# Altium project IntegratedShelfControl.PrjPCB (part 1 of 2)
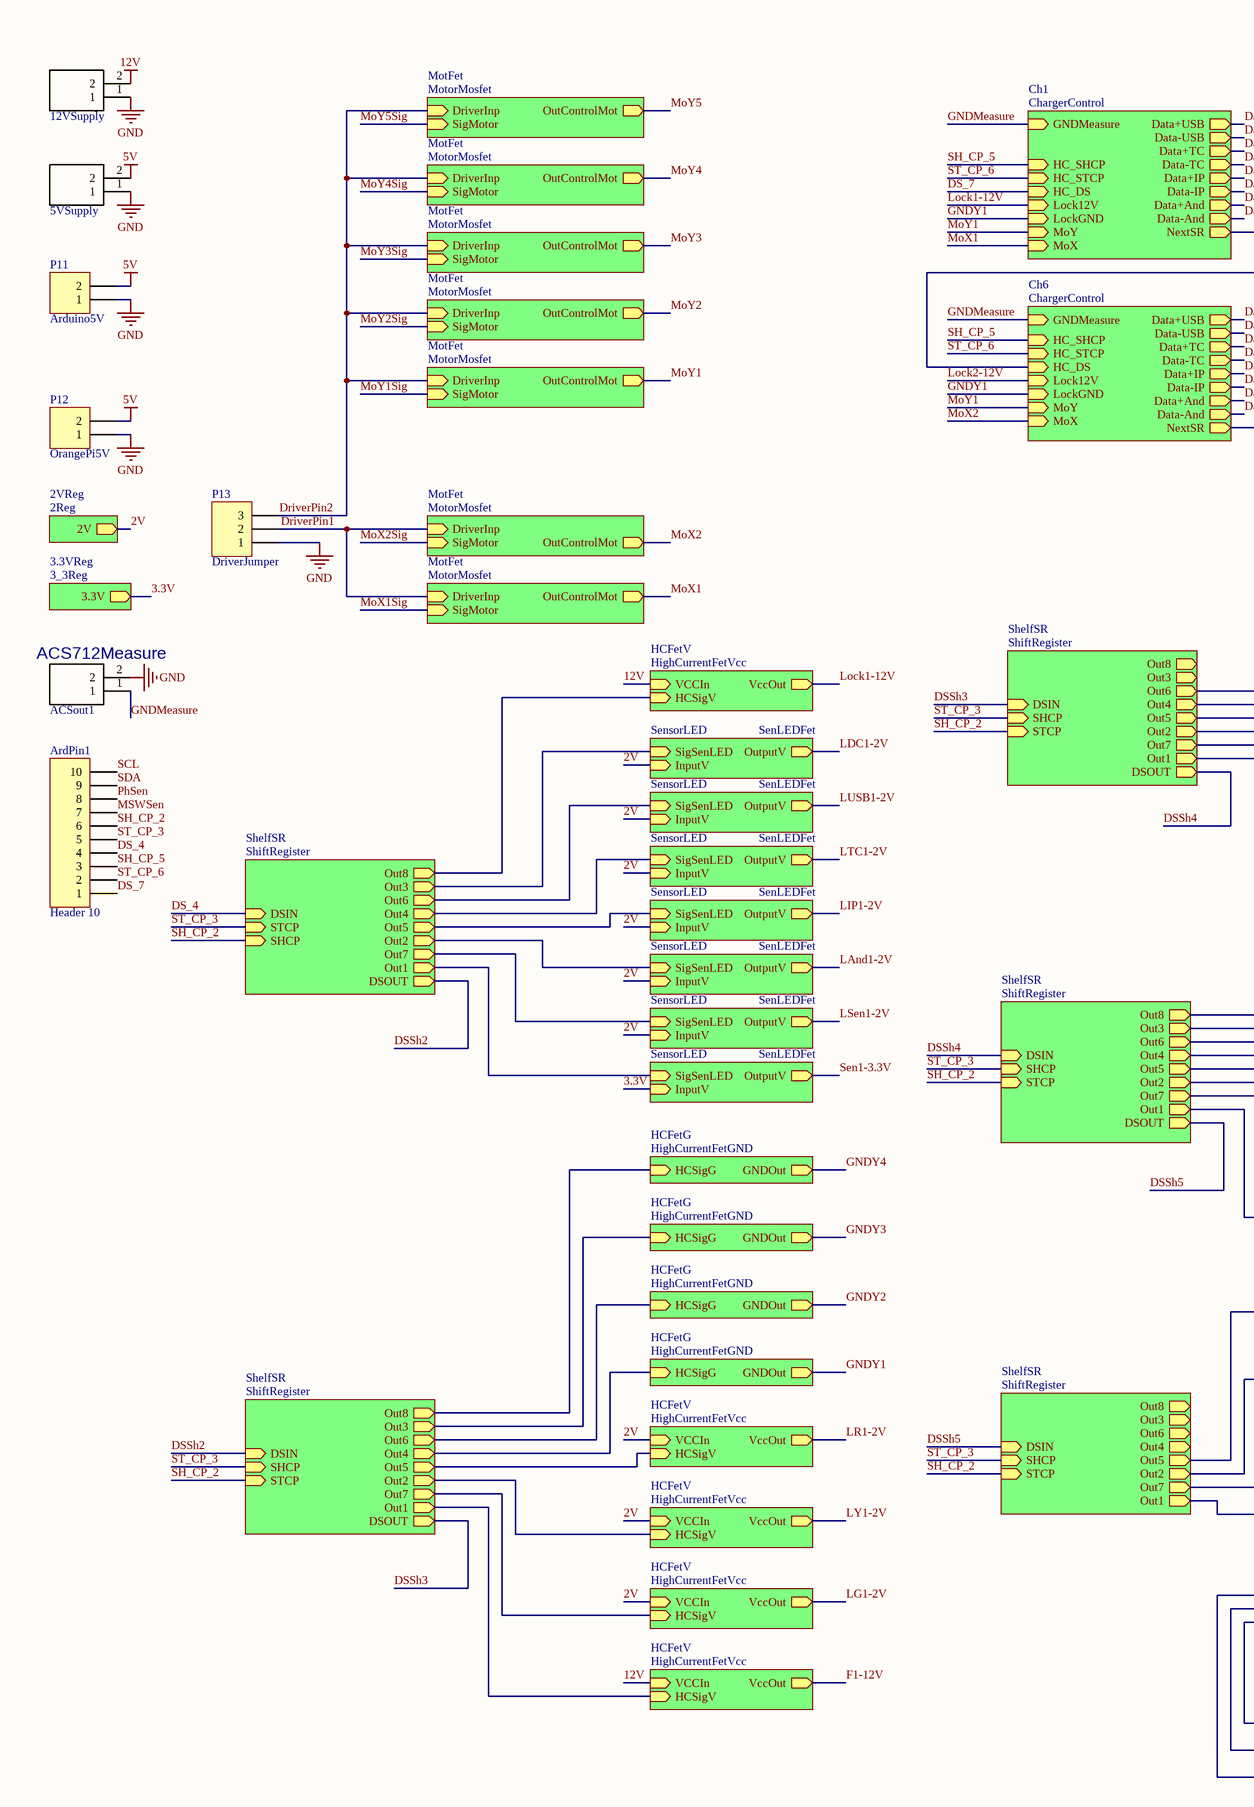
[diagram p0: ISC.SchDoc, left]
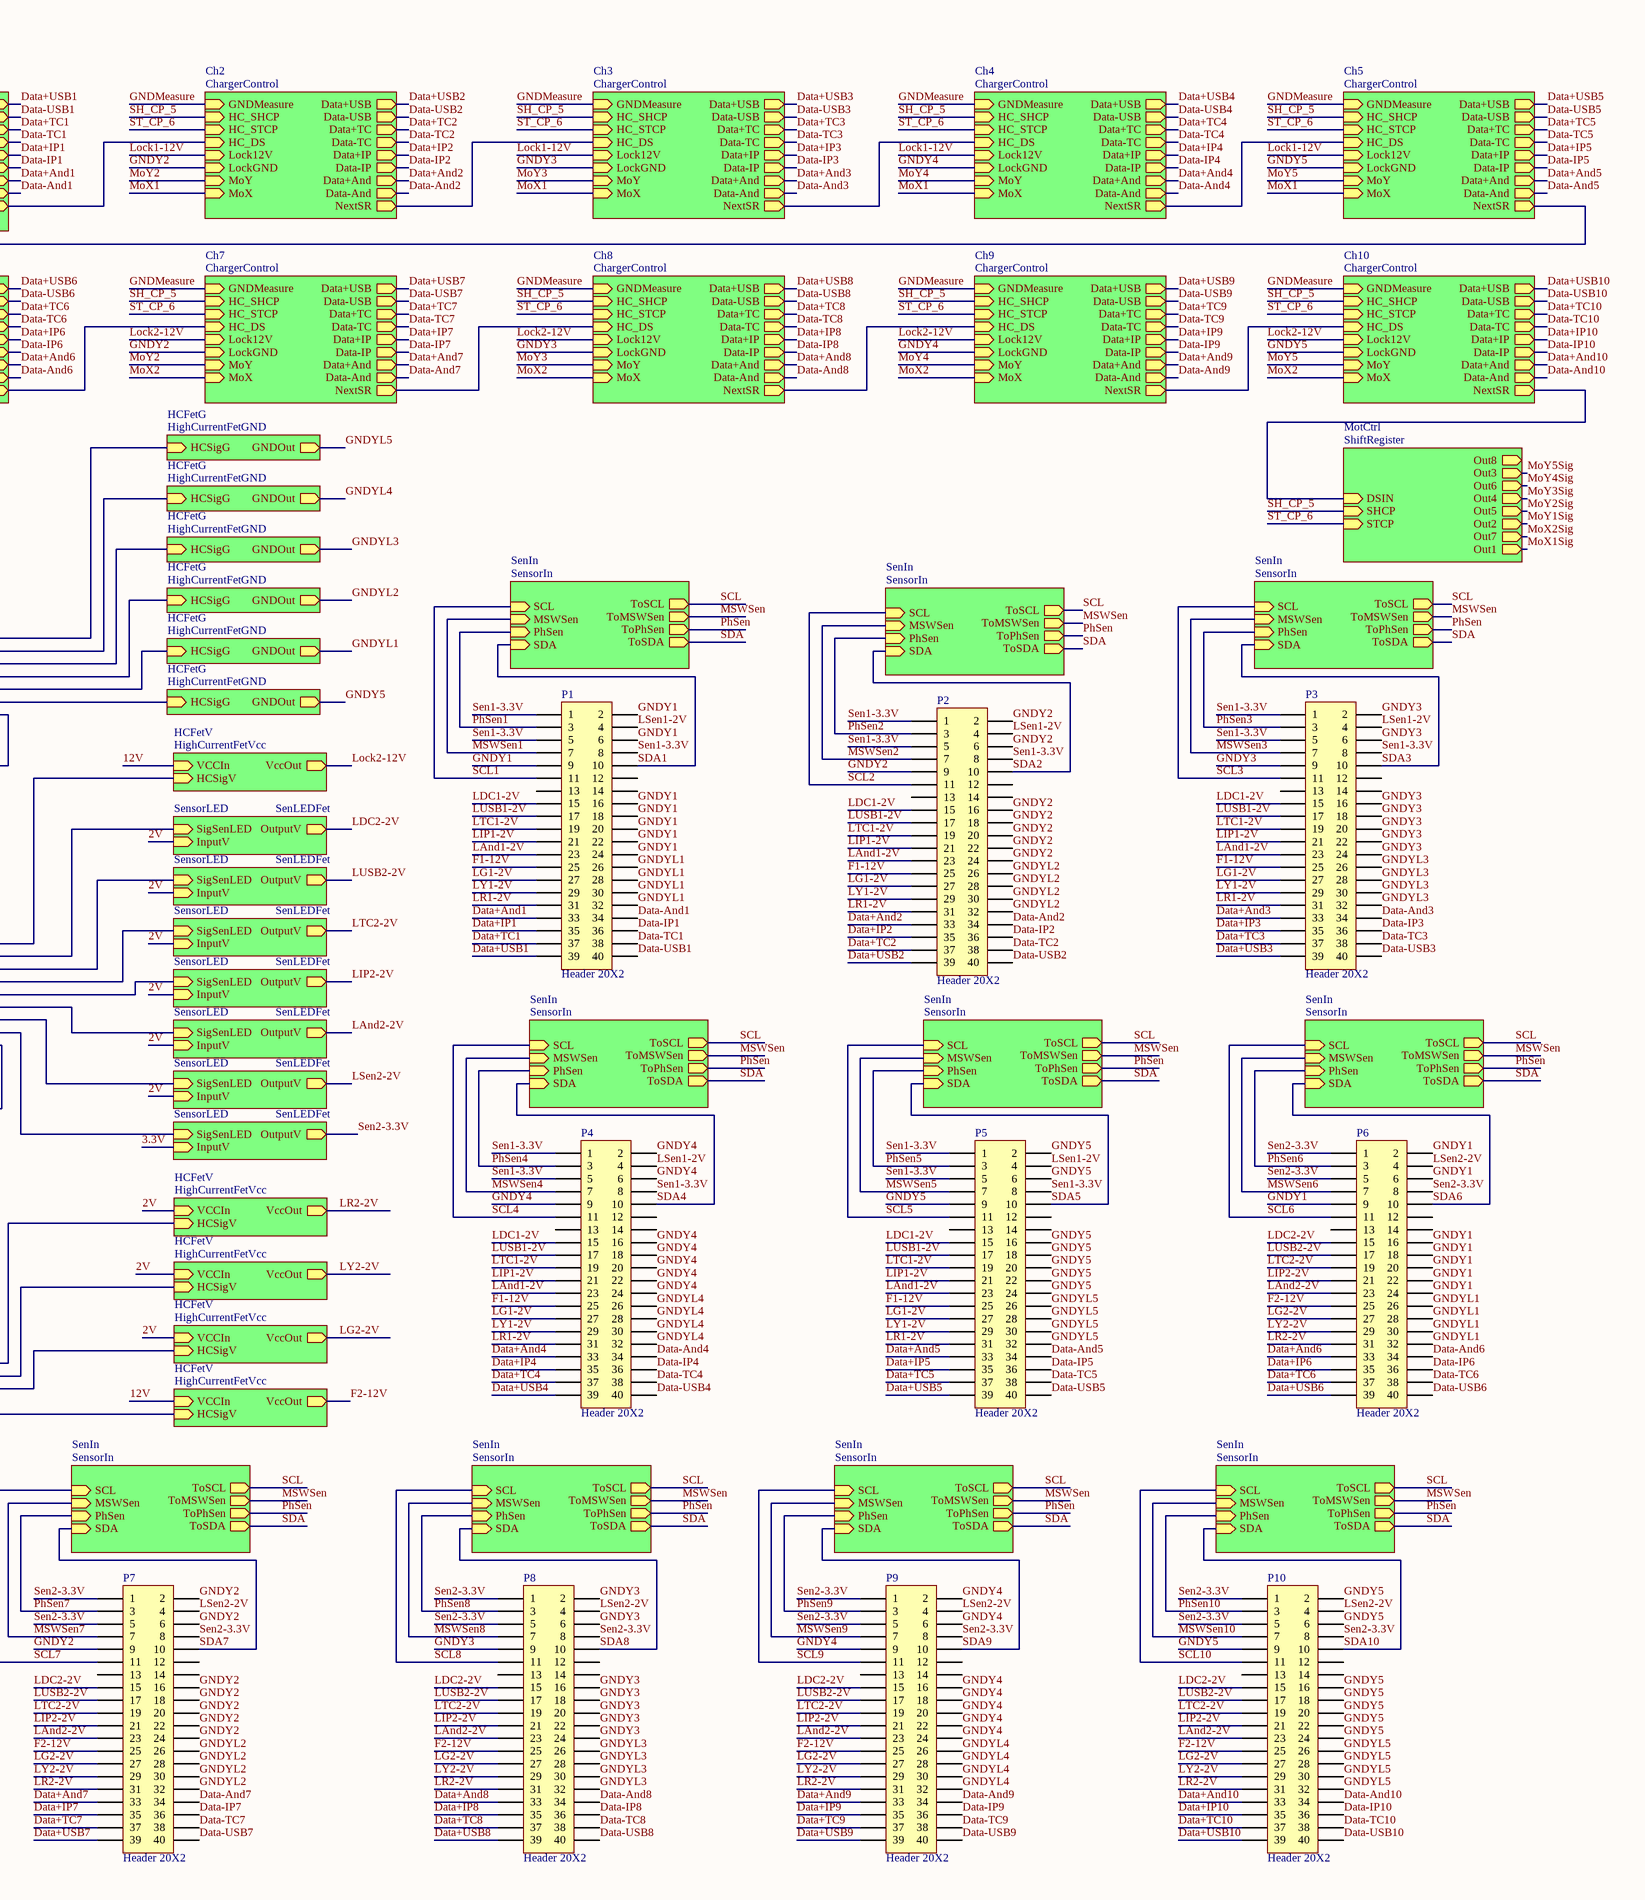
[diagram p1: ISC.SchDoc, right]
10 sheets, 689 parts. Net scope: hierarchical (ports join the sheet entries above them; power ports are global).
Board file: ISC.PcbDoc
Sheets:
  ISC.SchDoc
    Ch1 = ChargerControl.SchDoc
    MotFet = MotorMosfet.SchDoc
    3.3VReg = 3_3Reg.SchDoc
    2VReg = 2Reg.SchDoc
    HCFetV = HighCurrentFetVcc.SchDoc
    MotFet = MotorMosfet.SchDoc
    MotFet = MotorMosfet.SchDoc
    MotFet = MotorMosfet.SchDoc
    MotFet = MotorMosfet.SchDoc
    MotFet = MotorMosfet.SchDoc
    MotFet = MotorMosfet.SchDoc
    MotCtrl = ShiftRegister.SchDoc
    ShelfSR = ShiftRegister.SchDoc
    ShelfSR = ShiftRegister.SchDoc
    ShelfSR = ShiftRegister.SchDoc
    ShelfSR = ShiftRegister.SchDoc
    ShelfSR = ShiftRegister.SchDoc
    SensorLED = SenLEDFet.SchDoc
    HCFetV = HighCurrentFetVcc.SchDoc
    HCFetV = HighCurrentFetVcc.SchDoc
    HCFetV = HighCurrentFetVcc.SchDoc
    HCFetV = HighCurrentFetVcc.SchDoc
    HCFetG = HighCurrentFetGND.SchDoc
    HCFetG = HighCurrentFetGND.SchDoc
    HCFetG = HighCurrentFetGND.SchDoc
    HCFetG = HighCurrentFetGND.SchDoc
    SensorLED = SenLEDFet.SchDoc
    SensorLED = SenLEDFet.SchDoc
    SensorLED = SenLEDFet.SchDoc
    SensorLED = SenLEDFet.SchDoc
    SensorLED = SenLEDFet.SchDoc
    SensorLED = SenLEDFet.SchDoc
    HCFetG = HighCurrentFetGND.SchDoc
    HCFetG = HighCurrentFetGND.SchDoc
    HCFetG = HighCurrentFetGND.SchDoc
    HCFetG = HighCurrentFetGND.SchDoc
    HCFetG = HighCurrentFetGND.SchDoc
    HCFetG = HighCurrentFetGND.SchDoc
    HCFetV = HighCurrentFetVcc.SchDoc
    SensorLED = SenLEDFet.SchDoc
    SensorLED = SenLEDFet.SchDoc
    SensorLED = SenLEDFet.SchDoc
    SensorLED = SenLEDFet.SchDoc
    SensorLED = SenLEDFet.SchDoc
    SensorLED = SenLEDFet.SchDoc
    SensorLED = SenLEDFet.SchDoc
    HCFetV = HighCurrentFetVcc.SchDoc
    HCFetV = HighCurrentFetVcc.SchDoc
    HCFetV = HighCurrentFetVcc.SchDoc
    HCFetV = HighCurrentFetVcc.SchDoc
    Ch2 = ChargerControl.SchDoc
    Ch3 = ChargerControl.SchDoc
    Ch4 = ChargerControl.SchDoc
    Ch5 = ChargerControl.SchDoc
    Ch6 = ChargerControl.SchDoc
    Ch7 = ChargerControl.SchDoc
    Ch8 = ChargerControl.SchDoc
    Ch9 = ChargerControl.SchDoc
    Ch10 = ChargerControl.SchDoc
    SenIn = SensorIn.SchDoc
    SenIn = SensorIn.SchDoc
    SenIn = SensorIn.SchDoc
    SenIn = SensorIn.SchDoc
    SenIn = SensorIn.SchDoc
    SenIn = SensorIn.SchDoc
    SenIn = SensorIn.SchDoc
    SenIn = SensorIn.SchDoc
    SenIn = SensorIn.SchDoc
    SenIn = SensorIn.SchDoc

## Sheet ISC.SchDoc
size A2

### Parts
5VSupply  6-1123723-2  [*TE_6-1123723-2]  (value not drawn)
12VSupply  6-1123723-2  [*TE_6-1123723-2]  (value not drawn)
ACSout1  ACS712Measure  [*TE_6-1123723-2]
ArdPin1  Header 10  [HDR1X10]
P1  Header 20X2  [HDR2X20]
P2  Header 20X2  [HDR2X20]
P3  Header 20X2  [HDR2X20]
P4  Header 20X2  [HDR2X20]
P5  Header 20X2  [HDR2X20]
P6  Header 20X2  [HDR2X20]
P7  Header 20X2  [HDR2X20]
P8  Header 20X2  [HDR2X20]
P9  Header 20X2  [HDR2X20]
P10  Header 20X2  [HDR2X20]
P11  Arduino5V  [HDR1X2]
P12  OrangePi5V  [HDR1X2]
P13  DriverJumper  [HDR1X3]

### Sub-sheets
2VReg = 2Reg: 2V (out)
3.3VReg = 3_3Reg: 3.3V (out)
Ch1 = ChargerControl: GNDMeasure (in), HC_SHCP (in), HC_STCP (in), HC_DS (in), Data+USB (out), Data-USB (out), Data-TC (out), Data+TC (out), Data-And (out), Data+IP (out), Data-IP (out), Data+And (out), NextSR (out), Lock12V (in), LockGND (in), MoY (in), MoX (in)
Ch2 = ChargerControl: GNDMeasure (in), MoY (in), MoX (in), HC_SHCP (in), HC_STCP (in), HC_DS (in), Data+USB (out), Data-USB (out), Data-TC (out), Data+TC (out), Data-And (out), Data+IP (out), Data-IP (out), Data+And (out), NextSR (out), Lock12V (in), LockGND (in)
Ch3 = ChargerControl: GNDMeasure (in), MoY (in), MoX (in), HC_SHCP (in), HC_STCP (in), HC_DS (in), Data+USB (out), Data-USB (out), Data-TC (out), Data+TC (out), Data-And (out), Data+IP (out), Data-IP (out), Data+And (out), NextSR (out), Lock12V (in), LockGND (in)
Ch4 = ChargerControl: GNDMeasure (in), MoY (in), MoX (in), HC_SHCP (in), HC_STCP (in), HC_DS (in), Data+USB (out), Data-USB (out), Data-TC (out), Data+TC (out), Data-And (out), Data+IP (out), Data-IP (out), Data+And (out), NextSR (out), Lock12V (in), LockGND (in)
Ch5 = ChargerControl: GNDMeasure (in), MoY (in), MoX (in), HC_SHCP (in), HC_STCP (in), HC_DS (in), Data+USB (out), Data-USB (out), Data-TC (out), Data+TC (out), Data-And (out), Data+IP (out), Data-IP (out), Data+And (out), NextSR (out), Lock12V (in), LockGND (in)
Ch6 = ChargerControl: GNDMeasure (in), Data+USB (out), Data-USB (out), Data-TC (out), Data+TC (out), Data-And (out), Data+IP (out), Data-IP (out), Data+And (out), NextSR (out), HC_SHCP (in), HC_STCP (in), HC_DS (in), Lock12V (in), LockGND (in), MoY (in), MoX (in)
Ch7 = ChargerControl: GNDMeasure (in), MoY (in), MoX (in), HC_SHCP (in), HC_STCP (in), HC_DS (in), Data+USB (out), Data-USB (out), Data-TC (out), Data+TC (out), Data-And (out), Data+IP (out), Data-IP (out), Data+And (out), NextSR (out), Lock12V (in), LockGND (in)
Ch8 = ChargerControl: GNDMeasure (in), MoY (in), MoX (in), HC_SHCP (in), HC_STCP (in), HC_DS (in), Data+USB (out), Data-USB (out), Data-TC (out), Data+TC (out), Data-And (out), Data+IP (out), Data-IP (out), Data+And (out), NextSR (out), Lock12V (in), LockGND (in)
Ch9 = ChargerControl: GNDMeasure (in), MoY (in), MoX (in), HC_SHCP (in), HC_STCP (in), HC_DS (in), Data+USB (out), Data-USB (out), Data-TC (out), Data+TC (out), Data-And (out), Data+IP (out), Data-IP (out), Data+And (out), NextSR (out), Lock12V (in), LockGND (in)
Ch10 = ChargerControl: GNDMeasure (in), MoY (in), MoX (in), HC_SHCP (in), HC_STCP (in), HC_DS (in), Data+USB (out), Data-USB (out), Data-TC (out), Data+TC (out), Data-And (out), Data+IP (out), Data-IP (out), Data+And (out), NextSR (out), Lock12V (in), LockGND (in)
HCFetG = HighCurrentFetGND: HCSigG (in), GNDOut (out)
HCFetG = HighCurrentFetGND: HCSigG (in), GNDOut (out)
HCFetG = HighCurrentFetGND: HCSigG (in), GNDOut (out)
HCFetG = HighCurrentFetGND: HCSigG (in), GNDOut (out)
HCFetG = HighCurrentFetGND: HCSigG (in), GNDOut (out)
HCFetG = HighCurrentFetGND: HCSigG (in), GNDOut (out)
HCFetG = HighCurrentFetGND: HCSigG (in), GNDOut (out)
HCFetG = HighCurrentFetGND: HCSigG (in), GNDOut (out)
HCFetG = HighCurrentFetGND: HCSigG (in), GNDOut (out)
HCFetG = HighCurrentFetGND: HCSigG (in), GNDOut (out)
HCFetV = HighCurrentFetVcc: HCSigV (in), VCCIn (in), VccOut (out)
HCFetV = HighCurrentFetVcc: HCSigV (in), VCCIn (in), VccOut (out)
HCFetV = HighCurrentFetVcc: HCSigV (in), VCCIn (in), VccOut (out)
HCFetV = HighCurrentFetVcc: HCSigV (in), VCCIn (in), VccOut (out)
HCFetV = HighCurrentFetVcc: HCSigV (in), VCCIn (in), VccOut (out)
HCFetV = HighCurrentFetVcc: HCSigV (in), VCCIn (in), VccOut (out)
HCFetV = HighCurrentFetVcc: HCSigV (in), VCCIn (in), VccOut (out)
HCFetV = HighCurrentFetVcc: HCSigV (in), VCCIn (in), VccOut (out)
HCFetV = HighCurrentFetVcc: HCSigV (in), VCCIn (in), VccOut (out)
HCFetV = HighCurrentFetVcc: HCSigV (in), VCCIn (in), VccOut (out)
MotCtrl = ShiftRegister: DSIN (in), SHCP (in), STCP (in), Out8 (out), Out3 (out), Out6 (out), Out4 (out), Out5 (out), Out2 (out), Out7 (out), Out1 (out)
MotFet = MotorMosfet: DriverInp (in), SigMotor (in), OutControlMot (out)
MotFet = MotorMosfet: DriverInp (in), SigMotor (in), OutControlMot (out)
MotFet = MotorMosfet: DriverInp (in), SigMotor (in), OutControlMot (out)
MotFet = MotorMosfet: DriverInp (in), SigMotor (in), OutControlMot (out)
MotFet = MotorMosfet: DriverInp (in), SigMotor (in), OutControlMot (out)
MotFet = MotorMosfet: DriverInp (in), SigMotor (in), OutControlMot (out)
MotFet = MotorMosfet: DriverInp (in), SigMotor (in), OutControlMot (out)
SenIn = SensorIn: SCL (in), MSWSen (in), PhSen (in), SDA (in), ToSCL (out), ToMSWSen (out), ToPhSen (out), ToSDA (out)
SenIn = SensorIn: SCL (in), MSWSen (in), PhSen (in), SDA (in), ToSCL (out), ToMSWSen (out), ToPhSen (out), ToSDA (out)
SenIn = SensorIn: SCL (in), MSWSen (in), PhSen (in), SDA (in), ToSCL (out), ToMSWSen (out), ToPhSen (out), ToSDA (out)
SenIn = SensorIn: SCL (in), MSWSen (in), PhSen (in), SDA (in), ToSCL (out), ToMSWSen (out), ToPhSen (out), ToSDA (out)
SenIn = SensorIn: SCL (in), MSWSen (in), PhSen (in), SDA (in), ToSCL (out), ToMSWSen (out), ToPhSen (out), ToSDA (out)
SenIn = SensorIn: SCL (in), MSWSen (in), PhSen (in), SDA (in), ToSCL (out), ToMSWSen (out), ToPhSen (out), ToSDA (out)
SenIn = SensorIn: SCL (in), MSWSen (in), PhSen (in), SDA (in), ToSCL (out), ToMSWSen (out), ToPhSen (out), ToSDA (out)
SenIn = SensorIn: SCL (in), MSWSen (in), PhSen (in), SDA (in), ToSCL (out), ToMSWSen (out), ToPhSen (out), ToSDA (out)
SenIn = SensorIn: SCL (in), MSWSen (in), PhSen (in), SDA (in), ToSCL (out), ToMSWSen (out), ToPhSen (out), ToSDA (out)
SenIn = SensorIn: SCL (in), MSWSen (in), PhSen (in), SDA (in), ToSCL (out), ToMSWSen (out), ToPhSen (out), ToSDA (out)
SensorLED = SenLEDFet: SigSenLED (in), OutputV (out), InputV (in)
SensorLED = SenLEDFet: SigSenLED (in), OutputV (out), InputV (in)
SensorLED = SenLEDFet: SigSenLED (in), OutputV (out), InputV (in)
SensorLED = SenLEDFet: SigSenLED (in), OutputV (out), InputV (in)
SensorLED = SenLEDFet: SigSenLED (in), OutputV (out), InputV (in)
SensorLED = SenLEDFet: SigSenLED (in), OutputV (out), InputV (in)
SensorLED = SenLEDFet: SigSenLED (in), OutputV (out), InputV (in)
SensorLED = SenLEDFet: SigSenLED (in), OutputV (out), InputV (in)
SensorLED = SenLEDFet: SigSenLED (in), OutputV (out), InputV (in)
SensorLED = SenLEDFet: SigSenLED (in), OutputV (out), InputV (in)
SensorLED = SenLEDFet: SigSenLED (in), OutputV (out), InputV (in)
SensorLED = SenLEDFet: SigSenLED (in), OutputV (out), InputV (in)
SensorLED = SenLEDFet: SigSenLED (in), OutputV (out), InputV (in)
SensorLED = SenLEDFet: SigSenLED (in), OutputV (out), InputV (in)
ShelfSR = ShiftRegister: DSIN (in), SHCP (in), STCP (in), Out8 (out), Out3 (out), Out6 (out), Out4 (out), Out5 (out), Out2 (out), Out7 (out), Out1 (out), DSOUT (out)
ShelfSR = ShiftRegister: DSIN (in), SHCP (in), STCP (in), Out8 (out), Out3 (out), Out6 (out), Out4 (out), Out5 (out), Out2 (out), Out7 (out), Out1 (out), DSOUT (out)
ShelfSR = ShiftRegister: DSIN (in), SHCP (in), STCP (in), Out8 (out), Out3 (out), Out6 (out), Out4 (out), Out5 (out), Out2 (out), Out7 (out), Out1 (out), DSOUT (out)
ShelfSR = ShiftRegister: DSIN (in), SHCP (in), STCP (in), Out8 (out), Out3 (out), Out6 (out), Out4 (out), Out5 (out), Out2 (out), Out7 (out), Out1 (out), DSOUT (out)
ShelfSR = ShiftRegister: DSIN (in), SHCP (in), STCP (in), Out8 (out), Out3 (out), Out6 (out), Out4 (out), Out5 (out), Out2 (out), Out7 (out), Out1 (out)

### Nets
5V: 5VSupply.2 P11.2 P12.2
12V: 12VSupply.2 ; sheet HCFetV/VCCIn, sheet HCFetV/VCCIn, sheet HCFetV/VCCIn, sheet HCFetV/VCCIn
GND: 5VSupply.1 12VSupply.1 ACSout1.2 P11.1 P12.1 P13.1
2V: sheet 2VReg/2V, sheet SensorLED/InputV, sheet HCFetV/VCCIn, sheet HCFetV/VCCIn, sheet HCFetV/VCCIn, sheet SensorLED/InputV, sheet SensorLED/InputV, sheet SensorLED/InputV, sheet SensorLED/InputV, sheet SensorLED/InputV, sheet SensorLED/InputV, sheet SensorLED/InputV, sheet SensorLED/InputV, sheet SensorLED/InputV, sheet SensorLED/InputV, sheet SensorLED/InputV, sheet HCFetV/VCCIn, sheet HCFetV/VCCIn, sheet HCFetV/VCCIn
3.3V: sheet 3.3VReg/3.3V, sheet SensorLED/InputV, sheet SensorLED/InputV
Data+And1: P1.33 ; sheet Ch1/Data+And
Data+And2: P2.33 ; sheet Ch2/Data+And
Data+And3: P3.33 ; sheet Ch3/Data+And
Data+And4: P4.33 ; sheet Ch4/Data+And
Data+And5: P5.33 ; sheet Ch5/Data+And
Data+And6: P6.33 ; sheet Ch6/Data+And
Data+And7: P7.33 ; sheet Ch7/Data+And
Data+And8: P8.33 ; sheet Ch8/Data+And
Data+And9: P9.33 ; sheet Ch9/Data+And
Data+And10: P10.33 ; sheet Ch10/Data+And
Data+IP1: P1.35 ; sheet Ch1/Data+IP
Data+IP2: P2.35 ; sheet Ch2/Data+IP
Data+IP3: P3.35 ; sheet Ch3/Data+IP
Data+IP4: P4.35 ; sheet Ch4/Data+IP
Data+IP5: P5.35 ; sheet Ch5/Data+IP
Data+IP6: P6.35 ; sheet Ch6/Data+IP
Data+IP7: P7.35 ; sheet Ch7/Data+IP
Data+IP8: P8.35 ; sheet Ch8/Data+IP
Data+IP9: P9.35 ; sheet Ch9/Data+IP
Data+IP10: P10.35 ; sheet Ch10/Data+IP
Data+TC1: P1.37 ; sheet Ch1/Data+TC
Data+TC2: P2.37 ; sheet Ch2/Data+TC
Data+TC3: P3.37 ; sheet Ch3/Data+TC
Data+TC4: P4.37 ; sheet Ch4/Data+TC
Data+TC5: P5.37 ; sheet Ch5/Data+TC
Data+TC6: P6.37 ; sheet Ch6/Data+TC
Data+TC7: P7.37 ; sheet Ch7/Data+TC
Data+TC8: P8.37 ; sheet Ch8/Data+TC
Data+TC9: P9.37 ; sheet Ch9/Data+TC
Data+TC10: P10.37 ; sheet Ch10/Data+TC
Data+USB1: P1.39 ; sheet Ch1/Data+USB
Data+USB2: P2.39 ; sheet Ch2/Data+USB
Data+USB3: P3.39 ; sheet Ch3/Data+USB
Data+USB4: P4.39 ; sheet Ch4/Data+USB
Data+USB5: P5.39 ; sheet Ch5/Data+USB
Data+USB6: P6.39 ; sheet Ch6/Data+USB
Data+USB7: P7.39 ; sheet Ch7/Data+USB
Data+USB8: P8.39 ; sheet Ch8/Data+USB
Data+USB9: P9.39 ; sheet Ch9/Data+USB
Data+USB10: P10.39 ; sheet Ch10/Data+USB
Data-And1: P1.34 ; sheet Ch1/Data-And
Data-And2: P2.34 ; sheet Ch2/Data-And
Data-And3: P3.34 ; sheet Ch3/Data-And
Data-And4: P4.34 ; sheet Ch4/Data-And
Data-And5: P5.34 ; sheet Ch5/Data-And
Data-And6: P6.34 ; sheet Ch6/Data-And
Data-And7: P7.34 ; sheet Ch7/Data-And
Data-And8: P8.34 ; sheet Ch8/Data-And
Data-And9: P9.34 ; sheet Ch9/Data-And
Data-And10: P10.34 ; sheet Ch10/Data-And
Data-IP1: P1.36 ; sheet Ch1/Data-IP
Data-IP2: P2.36 ; sheet Ch2/Data-IP
Data-IP3: P3.36 ; sheet Ch3/Data-IP
Data-IP4: P4.36 ; sheet Ch4/Data-IP
Data-IP5: P5.36 ; sheet Ch5/Data-IP
Data-IP6: P6.36 ; sheet Ch6/Data-IP
Data-IP7: P7.36 ; sheet Ch7/Data-IP
Data-IP8: P8.36 ; sheet Ch8/Data-IP
Data-IP9: P9.36 ; sheet Ch9/Data-IP
Data-IP10: P10.36 ; sheet Ch10/Data-IP
Data-TC1: P1.38 ; sheet Ch1/Data-TC
Data-TC2: P2.38 ; sheet Ch2/Data-TC
Data-TC3: P3.38 ; sheet Ch3/Data-TC
Data-TC4: P4.38 ; sheet Ch4/Data-TC
Data-TC5: P5.38 ; sheet Ch5/Data-TC
Data-TC6: P6.38 ; sheet Ch6/Data-TC
Data-TC7: P7.38 ; sheet Ch7/Data-TC
Data-TC8: P8.38 ; sheet Ch8/Data-TC
Data-TC9: P9.38 ; sheet Ch9/Data-TC
Data-TC10: P10.38 ; sheet Ch10/Data-TC
Data-USB1: P1.40 ; sheet Ch1/Data-USB
Data-USB2: P2.40 ; sheet Ch2/Data-USB
Data-USB3: P3.40 ; sheet Ch3/Data-USB
Data-USB4: P4.40 ; sheet Ch4/Data-USB
Data-USB5: P5.40 ; sheet Ch5/Data-USB
Data-USB6: P6.40 ; sheet Ch6/Data-USB
Data-USB7: P7.40 ; sheet Ch7/Data-USB
Data-USB8: P8.40 ; sheet Ch8/Data-USB
Data-USB9: P9.40 ; sheet Ch9/Data-USB
Data-USB10: P10.40 ; sheet Ch10/Data-USB
DriverPin1: P13.2 ; sheet MotFet/DriverInp, sheet MotFet/DriverInp
DriverPin2: P13.3 ; sheet MotFet/DriverInp, sheet MotFet/DriverInp, sheet MotFet/DriverInp, sheet MotFet/DriverInp, sheet MotFet/DriverInp
DS_4: ArdPin1.4 ; sheet ShelfSR/DSIN
DS_7: ArdPin1.1 ; sheet Ch1/HC_DS
DSSh2: sheet ShelfSR/DSOUT, sheet ShelfSR/DSIN
DSSh3: sheet ShelfSR/DSOUT, sheet ShelfSR/DSIN
DSSh4: sheet ShelfSR/DSOUT, sheet ShelfSR/DSIN
DSSh5: sheet ShelfSR/DSOUT, sheet ShelfSR/DSIN
F1-12V: P1.25 P2.25 P3.25 P4.25 P5.25 ; sheet HCFetV/VccOut
F2-12V: P6.25 P7.25 P8.25 P9.25 P10.25 ; sheet HCFetV/VccOut
GNDMeasure: ACSout1.1 ; sheet Ch1/GNDMeasure, sheet Ch2/GNDMeasure, sheet Ch3/GNDMeasure, sheet Ch4/GNDMeasure, sheet Ch5/GNDMeasure, sheet Ch6/GNDMeasure, sheet Ch7/GNDMeasure, sheet Ch8/GNDMeasure, sheet Ch9/GNDMeasure, sheet Ch10/GNDMeasure
GNDY1: P1.2 P1.6 P1.9 P1.16 P1.18 P1.20 P1.22 P1.24 P6.2 P6.6 P6.9 P6.16 P6.18 P6.20 P6.22 P6.24 ; sheet Ch1/LockGND, sheet HCFetG/GNDOut, sheet Ch6/LockGND
GNDY2: P2.2 P2.6 P2.9 P2.16 P2.18 P2.20 P2.22 P2.24 P7.2 P7.6 P7.9 P7.16 P7.18 P7.20 P7.22 P7.24 ; sheet HCFetG/GNDOut, sheet Ch2/LockGND, sheet Ch7/LockGND
GNDY3: P3.2 P3.6 P3.9 P3.16 P3.18 P3.20 P3.22 P3.24 P8.2 P8.6 P8.9 P8.16 P8.18 P8.20 P8.22 P8.24 ; sheet HCFetG/GNDOut, sheet Ch3/LockGND, sheet Ch8/LockGND
GNDY4: P4.2 P4.6 P4.9 P4.16 P4.18 P4.20 P4.22 P4.24 P9.2 P9.6 P9.9 P9.16 P9.18 P9.20 P9.22 P9.24 ; sheet HCFetG/GNDOut, sheet Ch4/LockGND, sheet Ch9/LockGND
GNDY5: P5.2 P5.6 P5.9 P5.16 P5.18 P5.20 P5.22 P5.24 P10.2 P10.6 P10.9 P10.16 P10.18 P10.20 P10.22 P10.24 ; sheet HCFetG/GNDOut, sheet Ch5/LockGND, sheet Ch10/LockGND
GNDYL1: P1.26 P1.28 P1.30 P1.32 P6.26 P6.28 P6.30 P6.32 ; sheet HCFetG/GNDOut
GNDYL2: P2.26 P2.28 P2.30 P2.32 P7.26 P7.28 P7.30 P7.32 ; sheet HCFetG/GNDOut
GNDYL3: P3.26 P3.28 P3.30 P3.32 P8.26 P8.28 P8.30 P8.32 ; sheet HCFetG/GNDOut
GNDYL4: P4.26 P4.28 P4.30 P4.32 P9.26 P9.28 P9.30 P9.32 ; sheet HCFetG/GNDOut
GNDYL5: P5.26 P5.28 P5.30 P5.32 P10.26 P10.28 P10.30 P10.32 ; sheet HCFetG/GNDOut
LAnd1-2V: P1.23 P2.23 P3.23 P4.23 P5.23 ; sheet SensorLED/OutputV
LAnd2-2V: P6.23 P7.23 P8.23 P9.23 P10.23 ; sheet SensorLED/OutputV
LDC1-2V: P1.15 P2.15 P3.15 P4.15 P5.15 ; sheet SensorLED/OutputV
LDC2-2V: P6.15 P7.15 P8.15 P9.15 P10.15 ; sheet SensorLED/OutputV
LG1-2V: P1.27 P2.27 P3.27 P4.27 P5.27 ; sheet HCFetV/VccOut
LG2-2V: P6.27 P7.27 P8.27 P9.27 P10.27 ; sheet HCFetV/VccOut
LIP1-2V: P1.21 P2.21 P3.21 P4.21 P5.21 ; sheet SensorLED/OutputV
LIP2-2V: P6.21 P7.21 P8.21 P9.21 P10.21 ; sheet SensorLED/OutputV
Lock1-12V: sheet Ch1/Lock12V, sheet HCFetV/VccOut, sheet Ch2/Lock12V, sheet Ch3/Lock12V, sheet Ch4/Lock12V, sheet Ch5/Lock12V
Lock2-12V: sheet HCFetV/VccOut, sheet Ch6/Lock12V, sheet Ch7/Lock12V, sheet Ch8/Lock12V, sheet Ch9/Lock12V, sheet Ch10/Lock12V
LR1-2V: P1.31 P2.31 P3.31 P4.31 P5.31 ; sheet HCFetV/VccOut
LR2-2V: P6.31 P7.31 P8.31 P9.31 P10.31 ; sheet HCFetV/VccOut
LSen1-2V: P1.4 P2.4 P3.4 P4.4 P5.4 ; sheet SensorLED/OutputV
LSen2-2V: P6.4 P7.4 P8.4 P9.4 P10.4 ; sheet SensorLED/OutputV
LTC1-2V: P1.19 P2.19 P3.19 P4.19 P5.19 ; sheet SensorLED/OutputV
LTC2-2V: P6.19 P7.19 P8.19 P9.19 P10.19 ; sheet SensorLED/OutputV
LUSB1-2V: P1.17 P2.17 P3.17 P4.17 P5.17 ; sheet SensorLED/OutputV
LUSB2-2V: P6.17 P7.17 P8.17 P9.17 P10.17 ; sheet SensorLED/OutputV
LY1-2V: P1.29 P2.29 P3.29 P4.29 P5.29 ; sheet HCFetV/VccOut
LY2-2V: P6.29 P7.29 P8.29 P9.29 P10.29 ; sheet HCFetV/VccOut
MoX1: sheet Ch1/MoX, sheet MotFet/OutControlMot, sheet Ch2/MoX, sheet Ch3/MoX, sheet Ch4/MoX, sheet Ch5/MoX
MoX1Sig: sheet MotFet/SigMotor, sheet MotCtrl/Out1
MoX2: sheet MotFet/OutControlMot, sheet Ch6/MoX, sheet Ch7/MoX, sheet Ch8/MoX, sheet Ch9/MoX, sheet Ch10/MoX
MoX2Sig: sheet MotFet/SigMotor, sheet MotCtrl/Out7
MoY1: sheet Ch1/MoY, sheet MotFet/OutControlMot, sheet Ch6/MoY
MoY1Sig: sheet MotFet/SigMotor, sheet MotCtrl/Out2
MoY2: sheet MotFet/OutControlMot, sheet Ch2/MoY, sheet Ch7/MoY
MoY2Sig: sheet MotFet/SigMotor, sheet MotCtrl/Out5
MoY3: sheet MotFet/OutControlMot, sheet Ch3/MoY, sheet Ch8/MoY
MoY3Sig: sheet MotFet/SigMotor, sheet MotCtrl/Out4
MoY4: sheet MotFet/OutControlMot, sheet Ch4/MoY, sheet Ch9/MoY
MoY4Sig: sheet MotFet/SigMotor, sheet MotCtrl/Out6
MoY5: sheet MotFet/OutControlMot, sheet Ch5/MoY, sheet Ch10/MoY
MoY5Sig: sheet MotFet/SigMotor, sheet MotCtrl/Out3
MSWSen: ArdPin1.7 ; sheet SenIn/ToMSWSen, sheet SenIn/ToMSWSen, sheet SenIn/ToMSWSen, sheet SenIn/ToMSWSen, sheet SenIn/ToMSWSen, sheet SenIn/ToMSWSen, sheet SenIn/ToMSWSen, sheet SenIn/ToMSWSen, sheet SenIn/ToMSWSen, sheet SenIn/ToMSWSen
MSWSen1: P1.7 ; sheet SenIn/MSWSen
MSWSen2: P2.7 ; sheet SenIn/MSWSen
MSWSen3: P3.7 ; sheet SenIn/MSWSen
MSWSen4: P4.7 ; sheet SenIn/MSWSen
MSWSen5: P5.7 ; sheet SenIn/MSWSen
MSWSen6: P6.7 ; sheet SenIn/MSWSen
MSWSen7: P7.7 ; sheet SenIn/MSWSen
MSWSen8: P8.7 ; sheet SenIn/MSWSen
MSWSen9: P9.7 ; sheet SenIn/MSWSen
MSWSen10: P10.7 ; sheet SenIn/MSWSen
PhSen: ArdPin1.8 ; sheet SenIn/ToPhSen, sheet SenIn/ToPhSen, sheet SenIn/ToPhSen, sheet SenIn/ToPhSen, sheet SenIn/ToPhSen, sheet SenIn/ToPhSen, sheet SenIn/ToPhSen, sheet SenIn/ToPhSen, sheet SenIn/ToPhSen, sheet SenIn/ToPhSen
PhSen1: P1.3 ; sheet SenIn/PhSen
PhSen2: P2.3 ; sheet SenIn/PhSen
PhSen3: P3.3 ; sheet SenIn/PhSen
PhSen4: P4.3 ; sheet SenIn/PhSen
PhSen5: P5.3 ; sheet SenIn/PhSen
PhSen6: P6.3 ; sheet SenIn/PhSen
PhSen7: P7.3 ; sheet SenIn/PhSen
PhSen8: P8.3 ; sheet SenIn/PhSen
PhSen9: P9.3 ; sheet SenIn/PhSen
PhSen10: P10.3 ; sheet SenIn/PhSen
SCL: ArdPin1.10 ; sheet SenIn/ToSCL, sheet SenIn/ToSCL, sheet SenIn/ToSCL, sheet SenIn/ToSCL, sheet SenIn/ToSCL, sheet SenIn/ToSCL, sheet SenIn/ToSCL, sheet SenIn/ToSCL, sheet SenIn/ToSCL, sheet SenIn/ToSCL
SCL1: P1.11 ; sheet SenIn/SCL
SCL2: P2.11 ; sheet SenIn/SCL
SCL3: P3.11 ; sheet SenIn/SCL
SCL4: P4.11 ; sheet SenIn/SCL
SCL5: P5.11 ; sheet SenIn/SCL
SCL6: P6.11 ; sheet SenIn/SCL
SCL7: P7.11 ; sheet SenIn/SCL
SCL8: P8.11 ; sheet SenIn/SCL
SCL9: P9.11 ; sheet SenIn/SCL
SCL10: P10.11 ; sheet SenIn/SCL
SDA: ArdPin1.9 ; sheet SenIn/ToSDA, sheet SenIn/ToSDA, sheet SenIn/ToSDA, sheet SenIn/ToSDA, sheet SenIn/ToSDA, sheet SenIn/ToSDA, sheet SenIn/ToSDA, sheet SenIn/ToSDA, sheet SenIn/ToSDA, sheet SenIn/ToSDA
SDA1: P1.10 ; sheet SenIn/SDA
SDA2: P2.10 ; sheet SenIn/SDA
SDA3: P3.10 ; sheet SenIn/SDA
SDA4: P4.10 ; sheet SenIn/SDA
SDA5: P5.10 ; sheet SenIn/SDA
SDA6: P6.10 ; sheet SenIn/SDA
SDA7: P7.10 ; sheet SenIn/SDA
SDA8: P8.10 ; sheet SenIn/SDA
SDA9: P9.10 ; sheet SenIn/SDA
SDA10: P10.10 ; sheet SenIn/SDA
Sen1-3.3V: P1.1 P1.5 P1.8 P2.1 P2.5 P2.8 P3.1 P3.5 P3.8 P4.1 P4.5 P4.8 P5.1 P5.5 P5.8 ; sheet SensorLED/OutputV
Sen2-3.3V: P6.1 P6.5 P6.8 P7.1 P7.5 P7.8 P8.1 P8.5 P8.8 P9.1 P9.5 P9.8 P10.1 P10.5 P10.8 ; sheet SensorLED/OutputV
SH_CP_2: ArdPin1.6 ; sheet ShelfSR/SHCP, sheet ShelfSR/STCP, sheet ShelfSR/STCP, sheet ShelfSR/STCP, sheet ShelfSR/STCP
SH_CP_5: ArdPin1.3 ; sheet Ch1/HC_SHCP, sheet MotCtrl/SHCP, sheet Ch2/HC_SHCP, sheet Ch3/HC_SHCP, sheet Ch4/HC_SHCP, sheet Ch5/HC_SHCP, sheet Ch6/HC_SHCP, sheet Ch7/HC_SHCP, sheet Ch8/HC_SHCP, sheet Ch9/HC_SHCP, sheet Ch10/HC_SHCP
ST_CP_3: ArdPin1.5 ; sheet ShelfSR/STCP, sheet ShelfSR/SHCP, sheet ShelfSR/SHCP, sheet ShelfSR/SHCP, sheet ShelfSR/SHCP
ST_CP_6: ArdPin1.2 ; sheet Ch1/HC_STCP, sheet MotCtrl/STCP, sheet Ch2/HC_STCP, sheet Ch3/HC_STCP, sheet Ch4/HC_STCP, sheet Ch5/HC_STCP, sheet Ch6/HC_STCP, sheet Ch7/HC_STCP, sheet Ch8/HC_STCP, sheet Ch9/HC_STCP, sheet Ch10/HC_STCP
NetR21_HCFetG1_1: sheet ShelfSR/Out6, sheet HCFetG/HCSigG
NetR21_HCFetG2_1: sheet ShelfSR/Out4, sheet HCFetG/HCSigG
NetR21_HCFetG3_1: sheet ShelfSR/Out5, sheet HCFetG/HCSigG
NetR21_HCFetG4_1: sheet ShelfSR/Out2, sheet HCFetG/HCSigG
NetR21_HCFetG5_1: sheet ShelfSR/Out7, sheet HCFetG/HCSigG
NetR21_HCFetG6_1: sheet ShelfSR/Out1, sheet HCFetG/HCSigG
NetR21_HCFetG7_1: sheet ShelfSR/Out8, sheet HCFetG/HCSigG
NetR21_HCFetG8_1: sheet ShelfSR/Out3, sheet HCFetG/HCSigG
NetR21_HCFetG9_1: sheet ShelfSR/Out6, sheet HCFetG/HCSigG
NetR21_HCFetG10_1: sheet ShelfSR/Out4, sheet HCFetG/HCSigG
NetR23_HCFetV1_1: sheet ShelfSR/Out5, sheet HCFetV/HCSigV
NetR23_HCFetV2_1: sheet ShelfSR/Out2, sheet HCFetV/HCSigV
NetR23_HCFetV3_1: sheet ShelfSR/Out7, sheet HCFetV/HCSigV
NetR23_HCFetV4_1: sheet ShelfSR/Out1, sheet HCFetV/HCSigV
NetR23_HCFetV5_1: sheet ShelfSR/Out8, sheet HCFetV/HCSigV
NetR23_HCFetV6_1: sheet ShelfSR/Out5, sheet HCFetV/HCSigV
NetR23_HCFetV7_1: sheet ShelfSR/Out2, sheet HCFetV/HCSigV
NetR23_HCFetV8_1: sheet ShelfSR/Out7, sheet HCFetV/HCSigV
NetR23_HCFetV9_1: sheet ShelfSR/Out1, sheet HCFetV/HCSigV
NetR23_HCFetV10_1: sheet HCFetV/HCSigV, sheet ShelfSR/Out8
NetR27_SensorLED1_2: sheet ShelfSR/Out3, sheet SensorLED/SigSenLED
NetR27_SensorLED2_2: sheet ShelfSR/Out6, sheet SensorLED/SigSenLED
NetR27_SensorLED3_2: sheet ShelfSR/Out4, sheet SensorLED/SigSenLED
NetR27_SensorLED4_2: sheet ShelfSR/Out5, sheet SensorLED/SigSenLED
NetR27_SensorLED5_2: sheet ShelfSR/Out7, sheet SensorLED/SigSenLED
NetR27_SensorLED6_2: sheet ShelfSR/Out1, sheet SensorLED/SigSenLED
NetR27_SensorLED7_2: sheet ShelfSR/Out2, sheet SensorLED/SigSenLED
NetR27_SensorLED8_2: sheet ShelfSR/Out3, sheet SensorLED/SigSenLED
NetR27_SensorLED9_2: sheet ShelfSR/Out6, sheet SensorLED/SigSenLED
NetR27_SensorLED10_2: sheet ShelfSR/Out4, sheet SensorLED/SigSenLED
NetR27_SensorLED11_2: sheet ShelfSR/Out5, sheet SensorLED/SigSenLED
NetR27_SensorLED12_2: sheet ShelfSR/Out7, sheet SensorLED/SigSenLED
NetR27_SensorLED13_2: sheet ShelfSR/Out1, sheet SensorLED/SigSenLED
NetR27_SensorLED14_2: sheet ShelfSR/Out2, sheet SensorLED/SigSenLED
NetSR1_Ch1_9: sheet Ch1/NextSR, sheet Ch2/HC_DS
NetSR1_Ch2_9: sheet Ch2/NextSR, sheet Ch3/HC_DS
NetSR1_Ch3_9: sheet Ch3/NextSR, sheet Ch4/HC_DS
NetSR1_Ch4_9: sheet Ch4/NextSR, sheet Ch5/HC_DS
NetSR1_Ch5_9: sheet Ch5/NextSR, sheet Ch6/HC_DS
NetSR1_Ch6_9: sheet Ch6/NextSR, sheet Ch7/HC_DS
NetSR1_Ch7_9: sheet Ch7/NextSR, sheet Ch8/HC_DS
NetSR1_Ch8_9: sheet Ch8/NextSR, sheet Ch9/HC_DS
NetSR1_Ch9_9: sheet Ch9/NextSR, sheet Ch10/HC_DS
NetSR1_Ch10_9: sheet MotCtrl/DSIN, sheet Ch10/NextSR

Not connected (* = marked no-connect by the designer): P1 12 13 14; P2 12 13 14; P3 12 13 14; P4 12 13 14; P5 12 13 14; P6 12 13 14; P7 12 13 14; P8 12 13 14; P9 12 13 14; P10 12 13 14

### Notes on the sheet
- Title
- Size:
- Date:
- File:
- A2
- Number:
- Time:
- Revision:
- Sheet
- of

### Library data of the parts
5VSupply 12VSupply ACSout1 = 6-1123723-2: 3.96 EP HDR ASSY 2P_GREEN_; MF: TE Connectivity; Number_of_Positions: 2; Product_Type: Header; Centerline_Pitch: 3.96 mm[.156 in]; TE_purchase_URL: https://www.te.com/usa-en/product-6-1123723-2.html?te_bu=Cor&te_type=disp&te_campaign=seda_glo_cor-seda-global-disp-prtnr-fy19-seda-model-bom-cta_sma-317_1&elqCampaignId=32493; MP: 6-1123723-2; Price: None; Availability: Unavailable; Package: None; EU_RoHS_Compliance: Compliant; SnapEDA_Link: https://www.snapeda.com/parts/6-1123723-2/TE%20Connectivity%20AMP%20Connectors/view-part/?ref=snap; Value: *
ArdPin1 = Header 10: Header, 10-Pin; LatestRevisionDate: 17-Jul-2002; LatestRevisionNote: Re-released for DXP Platform.; Publisher: Altium Limited
P1-P10 = Header 20X2: Header, 20-Pin, Dual row; LatestRevisionDate: 17-Jul-2002; LatestRevisionNote: Re-released for DXP Platform.; Publisher: Altium Limited
P11 P12 = Header 2: Header, 2-Pin; LatestRevisionDate: 17-Jul-2002; LatestRevisionNote: Re-released for DXP Platform.; Publisher: Altium Limited
P13 = Header 3: Header, 3-Pin; LatestRevisionDate: 17-Jul-2002; LatestRevisionNote: Re-released for DXP Platform.; Publisher: Altium Limited

## Sheet ChargerControl.SchDoc
size A3
Used 10 times, as channels Ch1, Ch2, Ch3, Ch4, Ch5, Ch6, Ch7, Ch8, Ch9, Ch10. Parts and nets are listed once, with the designators drawn on the sheet.
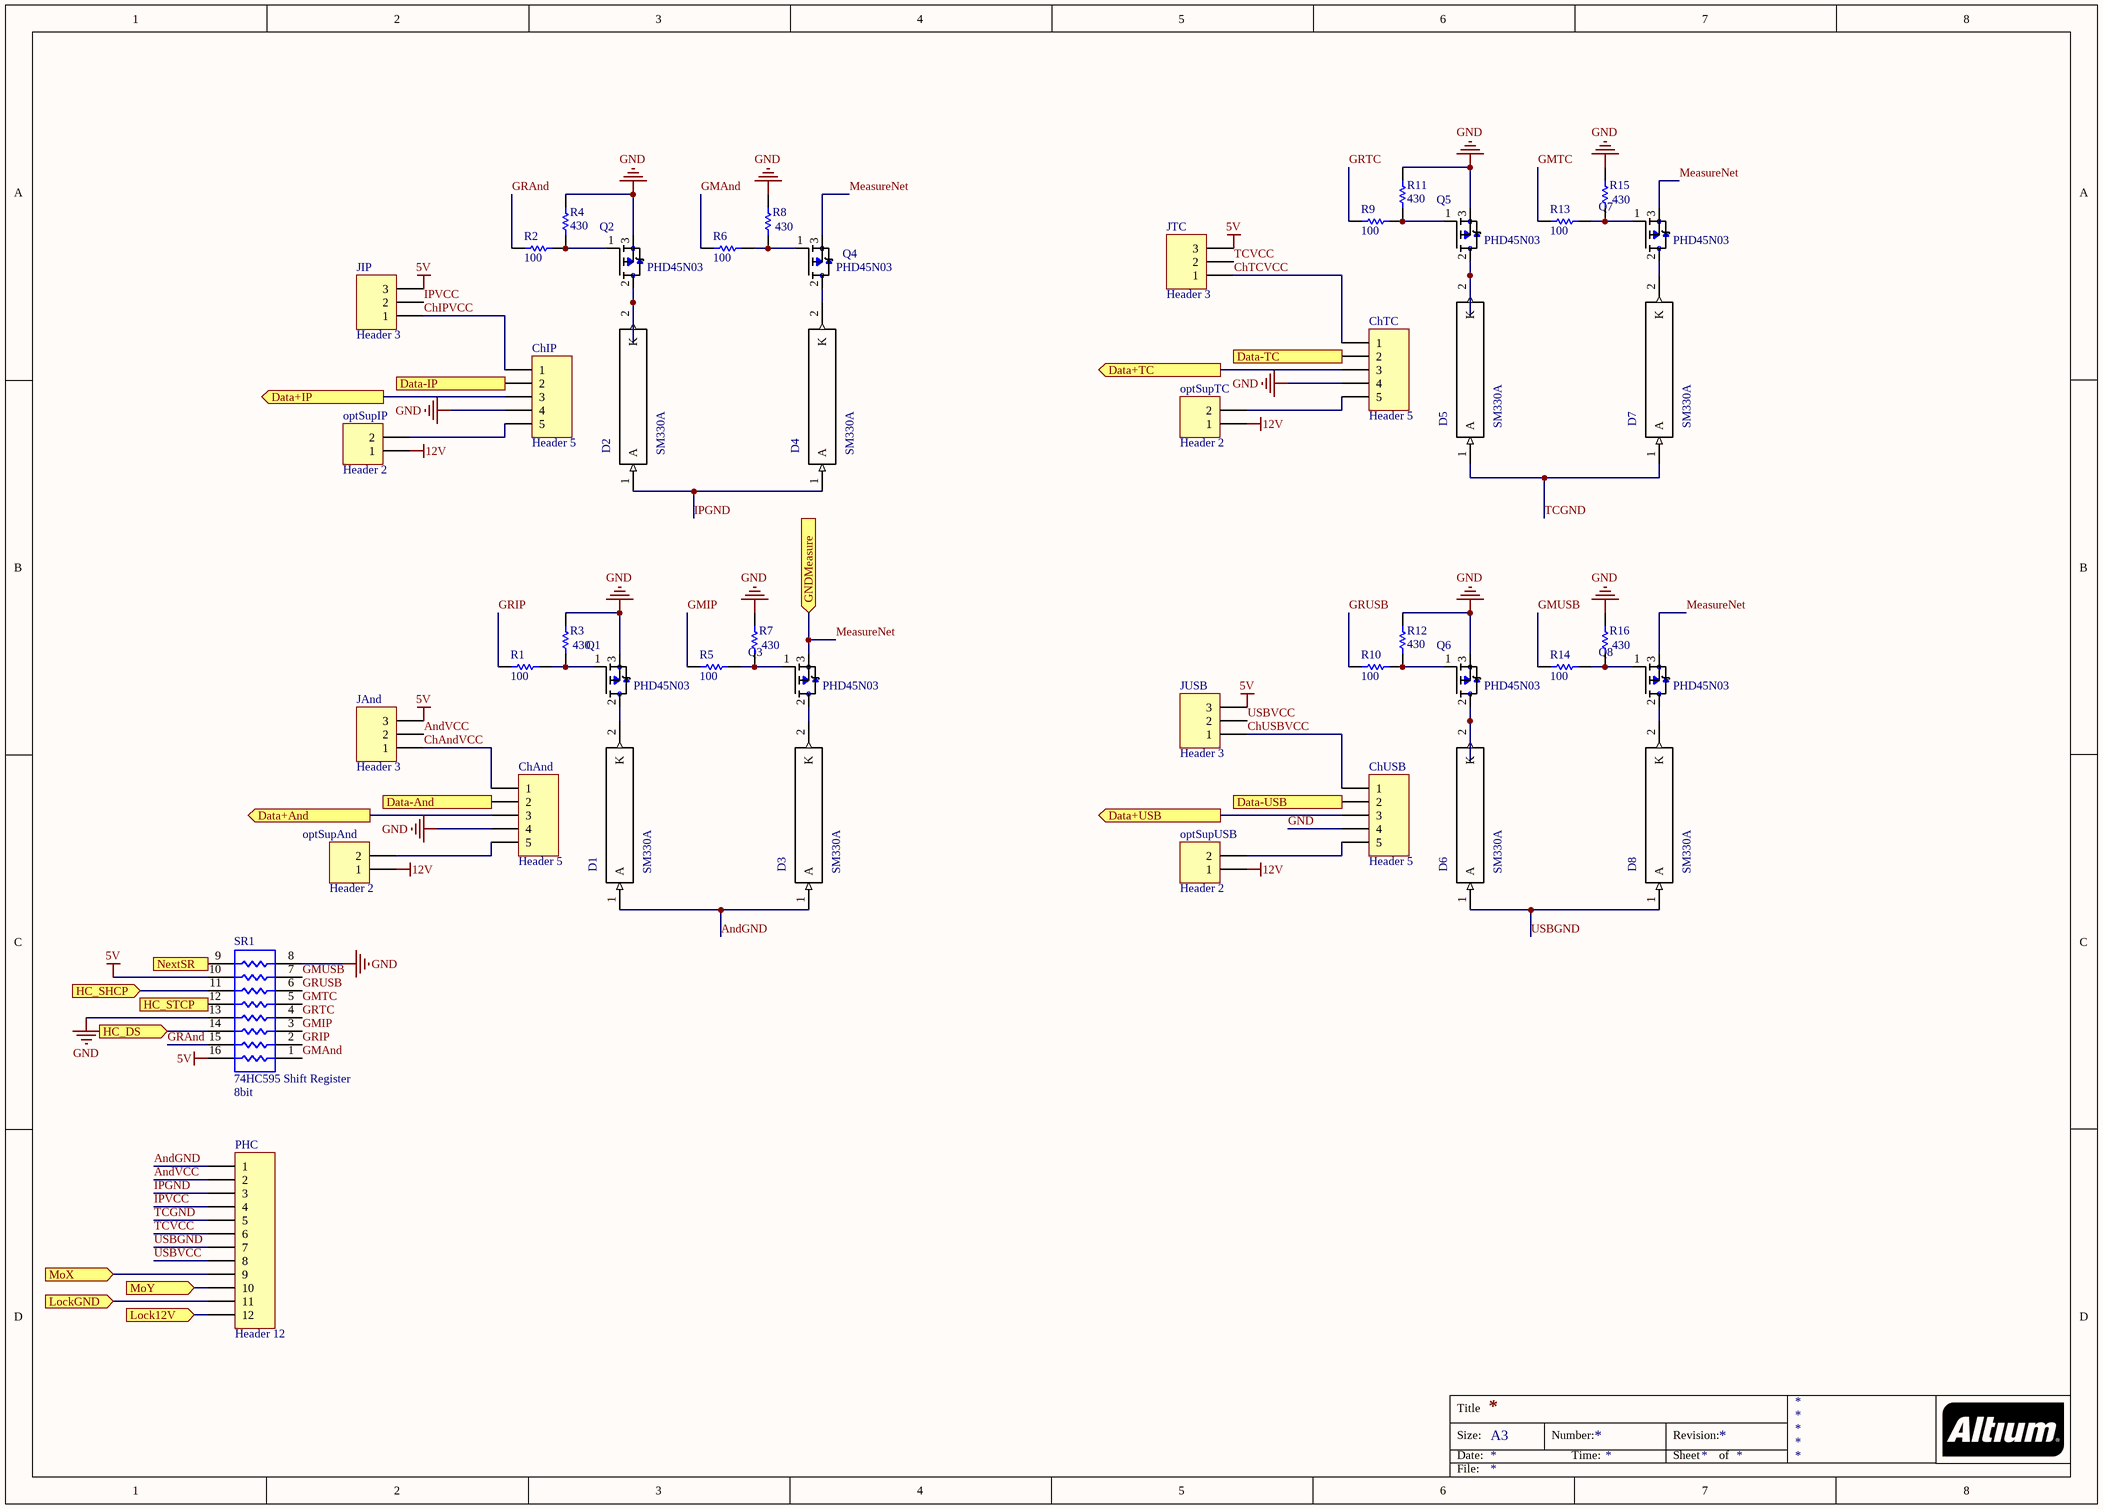
[diagram p2: ChargerControl.SchDoc]

### Parts
ChAnd  Header 5  [HDR1X5]
ChIP  Header 5  [HDR1X5]
ChTC  Header 5  [HDR1X5]
ChUSB  Header 5  [HDR1X5]
D1  SM330A  [*DIOM5227X270N_S1M(Primary)]
D2  SM330A  [*DIOM5227X270N_S1M(Primary)]
D3  SM330A  [*DIOM5227X270N_S1M(Primary)]
D4  SM330A  [*DIOM5227X270N_S1M(Primary)]
D5  SM330A  [*DIOM5227X270N_S1M(Primary)]
D6  SM330A  [*DIOM5227X270N_S1M(Primary)]
D7  SM330A  [*DIOM5227X270N_S1M(Primary)]
D8  SM330A  [*DIOM5227X270N_S1M(Primary)]
JAnd  Header 3  [HDR1X3]
JIP  Header 3  [HDR1X3]
JTC  Header 3  [HDR1X3]
JUSB  Header 3  [HDR1X3]
optSupAnd  Header 2  [HDR1X2]
optSupIP  Header 2  [HDR1X2]
optSupTC  Header 2  [HDR1X2]
optSupUSB  Header 2  [HDR1X2]
PHC  Header 12  [HDR1X12]
Q1  PHD45N03  [*DPAK228P998X235-3N]
Q2  PHD45N03  [*DPAK228P998X235-3N]
Q3  PHD45N03  [*DPAK228P998X235-3N]
Q4  PHD45N03  [*DPAK228P998X235-3N]
Q5  PHD45N03  [*DPAK228P998X235-3N]
Q6  PHD45N03  [*DPAK228P998X235-3N]
Q7  PHD45N03  [*DPAK228P998X235-3N]
Q8  PHD45N03  [*DPAK228P998X235-3N]
R1  value 100  [6-0805_L]  (hidden comment: R100)
R2  value 100  [6-0805_L]  (hidden comment: R100)
R3  value 430  [6-0805_L]  (hidden comment: R430)
R4  value 430  [6-0805_L]  (hidden comment: R430)
R5  value 100  [6-0805_L]  (hidden comment: R100)
R6  value 100  [6-0805_L]  (hidden comment: R100)
R7  value 430  [6-0805_L]  (hidden comment: R430)
R8  value 430  [6-0805_L]  (hidden comment: R430)
R9  value 100  [6-0805_L]  (hidden comment: R100)
R10  value 100  [6-0805_L]  (hidden comment: R100)
R11  value 430  [6-0805_L]  (hidden comment: R430)
R12  value 430  [6-0805_L]  (hidden comment: R430)
R13  value 100  [6-0805_L]  (hidden comment: R100)
R14  value 100  [6-0805_L]  (hidden comment: R100)
R15  value 430  [6-0805_L]  (hidden comment: R430)
R16  value 430  [6-0805_L]  (hidden comment: R430)
SR1  74HC595 Shift Register  value 8bit  [SO-16_L]

### Ports
Data+And (out), Data+IP (out), Data+TC (out), Data+USB (out), Data-And (out), Data-IP (out), Data-TC (out), Data-USB (out), GNDMeasure (in), HC_DS (in), HC_SHCP (in), HC_STCP (in), Lock12V (in), LockGND (in), MoX (in), MoY (in), NextSR (out)

### Nets
5V: JAnd.3 JIP.3 JTC.3 JUSB.3 SR1.10 SR1.16
12V: optSupAnd.1 optSupIP.1 optSupTC.1 optSupUSB.1
GND: ChAnd.4 ChIP.4 ChTC.4 ChUSB.4 Q1.3(S) Q2.3(S) Q5.3(S) Q6.3(S) R3.1 R4.1 R7.1 R8.1 R11.1 R12.1 R15.1 R16.1 SR1.8 SR1.13
AndGND: D1.1(A) D3.1(A) PHC.1
AndVCC: JAnd.2 PHC.2
ChAndVCC: ChAnd.1 JAnd.1
ChIPVCC: ChIP.1 JIP.1
ChTCVCC: ChTC.1 JTC.1
ChUSBVCC: ChUSB.1 JUSB.1
Data+And: ChAnd.3 ; port Data+And
Data+IP: ChIP.3 ; port Data+IP
Data+TC: ChTC.3 ; port Data+TC
Data+USB: ChUSB.3 ; port Data+USB
Data-And: ChAnd.2 ; port Data-And
Data-IP: ChIP.2 ; port Data-IP
Data-TC: ChTC.2 ; port Data-TC
Data-USB: ChUSB.2 ; port Data-USB
GMAnd: R6.1 SR1.1
GMIP: R5.1 SR1.3
GMTC: R13.1 SR1.5
GMUSB: R14.1 SR1.7
GRAnd: R2.1 SR1.15
GRIP: R1.1 SR1.2
GRTC: R9.1 SR1.4
GRUSB: R10.1 SR1.6
HC_DS: SR1.14 ; port HC_DS
HC_SHCP: SR1.11 ; port HC_SHCP
HC_STCP: SR1.12 ; port HC_STCP
IPGND: D2.1(A) D4.1(A) PHC.3
IPVCC: JIP.2 PHC.4
Lock12V: PHC.12 ; port Lock12V
LockGND: PHC.11 ; port LockGND
MeasureNet: Q3.3(S) Q4.3(S) Q7.3(S) Q8.3(S) ; port GNDMeasure
MoX: PHC.9 ; port MoX
MoY: PHC.10 ; port MoY
NextSR: SR1.9 ; port NextSR
TCGND: D5.1(A) D7.1(A) PHC.5
TCVCC: JTC.2 PHC.6
USBGND: D6.1(A) D8.1(A) PHC.7
USBVCC: JUSB.2 PHC.8
NetChAnd_5: ChAnd.5 optSupAnd.2
NetChIP_5: ChIP.5 optSupIP.2
NetChTC_5: ChTC.5 optSupTC.2
NetChUSB_5: ChUSB.5 optSupUSB.2
NetD1_2: D1.2(K) Q1.2(D)
NetD2_2: D2.2(K) Q2.2(D)
NetD3_2: D3.2(K) Q3.2(D)
NetD4_2: D4.2(K) Q4.2(D)
NetD5_2: D5.2(K) Q5.2(D)
NetD6_2: D6.2(K) Q6.2(D)
NetD7_2: D7.2(K) Q7.2(D)
NetD8_2: D8.2(K) Q8.2(D)
NetQ1_1: Q1.1(G) R1.2 R3.2
NetQ2_1: Q2.1(G) R2.2 R4.2
NetQ3_1: Q3.1(G) R5.2 R7.2
NetQ4_1: Q4.1(G) R6.2 R8.2
NetQ5_1: Q5.1(G) R9.2 R11.2
NetQ6_1: Q6.1(G) R10.2 R12.2
NetQ7_1: Q7.1(G) R13.2 R15.2
NetQ8_1: Q8.1(G) R14.2 R16.2

### Channels
Ch1: designators end in _Ch1; ports Data+And=Data+And1 Data+IP=Data+IP1 Data+TC=Data+TC1 Data+USB=Data+USB1 Data-And=Data-And1 Data-IP=Data-IP1 Data-TC=Data-TC1 Data-USB=Data-USB1 GNDMeasure=GNDMeasure HC_DS=DS_7 HC_SHCP=SH_CP_5 HC_STCP=ST_CP_6 Lock12V=Lock1-12V LockGND=GNDY1 MoX=MoX1 MoY=MoY1 NextSR=NetSR1_Ch1_9
Ch2: designators end in _Ch2; ports Data+And=Data+And2 Data+IP=Data+IP2 Data+TC=Data+TC2 Data+USB=Data+USB2 Data-And=Data-And2 Data-IP=Data-IP2 Data-TC=Data-TC2 Data-USB=Data-USB2 GNDMeasure=GNDMeasure HC_DS=NetSR1_Ch1_9 HC_SHCP=SH_CP_5 HC_STCP=ST_CP_6 Lock12V=Lock1-12V LockGND=GNDY2 MoX=MoX1 MoY=MoY2 NextSR=NetSR1_Ch2_9
Ch3: designators end in _Ch3; ports Data+And=Data+And3 Data+IP=Data+IP3 Data+TC=Data+TC3 Data+USB=Data+USB3 Data-And=Data-And3 Data-IP=Data-IP3 Data-TC=Data-TC3 Data-USB=Data-USB3 GNDMeasure=GNDMeasure HC_DS=NetSR1_Ch2_9 HC_SHCP=SH_CP_5 HC_STCP=ST_CP_6 Lock12V=Lock1-12V LockGND=GNDY3 MoX=MoX1 MoY=MoY3 NextSR=NetSR1_Ch3_9
Ch4: designators end in _Ch4; ports Data+And=Data+And4 Data+IP=Data+IP4 Data+TC=Data+TC4 Data+USB=Data+USB4 Data-And=Data-And4 Data-IP=Data-IP4 Data-TC=Data-TC4 Data-USB=Data-USB4 GNDMeasure=GNDMeasure HC_DS=NetSR1_Ch3_9 HC_SHCP=SH_CP_5 HC_STCP=ST_CP_6 Lock12V=Lock1-12V LockGND=GNDY4 MoX=MoX1 MoY=MoY4 NextSR=NetSR1_Ch4_9
Ch5: designators end in _Ch5; ports Data+And=Data+And5 Data+IP=Data+IP5 Data+TC=Data+TC5 Data+USB=Data+USB5 Data-And=Data-And5 Data-IP=Data-IP5 Data-TC=Data-TC5 Data-USB=Data-USB5 GNDMeasure=GNDMeasure HC_DS=NetSR1_Ch4_9 HC_SHCP=SH_CP_5 HC_STCP=ST_CP_6 Lock12V=Lock1-12V LockGND=GNDY5 MoX=MoX1 MoY=MoY5 NextSR=NetSR1_Ch5_9
Ch6: designators end in _Ch6; ports Data+And=Data+And6 Data+IP=Data+IP6 Data+TC=Data+TC6 Data+USB=Data+USB6 Data-And=Data-And6 Data-IP=Data-IP6 Data-TC=Data-TC6 Data-USB=Data-USB6 GNDMeasure=GNDMeasure HC_DS=NetSR1_Ch5_9 HC_SHCP=SH_CP_5 HC_STCP=ST_CP_6 Lock12V=Lock2-12V LockGND=GNDY1 MoX=MoX2 MoY=MoY1 NextSR=NetSR1_Ch6_9
Ch7: designators end in _Ch7; ports Data+And=Data+And7 Data+IP=Data+IP7 Data+TC=Data+TC7 Data+USB=Data+USB7 Data-And=Data-And7 Data-IP=Data-IP7 Data-TC=Data-TC7 Data-USB=Data-USB7 GNDMeasure=GNDMeasure HC_DS=NetSR1_Ch6_9 HC_SHCP=SH_CP_5 HC_STCP=ST_CP_6 Lock12V=Lock2-12V LockGND=GNDY2 MoX=MoX2 MoY=MoY2 NextSR=NetSR1_Ch7_9
Ch8: designators end in _Ch8; ports Data+And=Data+And8 Data+IP=Data+IP8 Data+TC=Data+TC8 Data+USB=Data+USB8 Data-And=Data-And8 Data-IP=Data-IP8 Data-TC=Data-TC8 Data-USB=Data-USB8 GNDMeasure=GNDMeasure HC_DS=NetSR1_Ch7_9 HC_SHCP=SH_CP_5 HC_STCP=ST_CP_6 Lock12V=Lock2-12V LockGND=GNDY3 MoX=MoX2 MoY=MoY3 NextSR=NetSR1_Ch8_9
Ch9: designators end in _Ch9; ports Data+And=Data+And9 Data+IP=Data+IP9 Data+TC=Data+TC9 Data+USB=Data+USB9 Data-And=Data-And9 Data-IP=Data-IP9 Data-TC=Data-TC9 Data-USB=Data-USB9 GNDMeasure=GNDMeasure HC_DS=NetSR1_Ch8_9 HC_SHCP=SH_CP_5 HC_STCP=ST_CP_6 Lock12V=Lock2-12V LockGND=GNDY4 MoX=MoX2 MoY=MoY4 NextSR=NetSR1_Ch9_9
Ch10: designators end in _Ch10; ports Data+And=Data+And10 Data+IP=Data+IP10 Data+TC=Data+TC10 Data+USB=Data+USB10 Data-And=Data-And10 Data-IP=Data-IP10 Data-TC=Data-TC10 Data-USB=Data-USB10 GNDMeasure=GNDMeasure HC_DS=NetSR1_Ch9_9 HC_SHCP=SH_CP_5 HC_STCP=ST_CP_6 Lock12V=Lock2-12V LockGND=GNDY5 MoX=MoX2 MoY=MoY5 NextSR=NetSR1_Ch10_9

### Notes on the sheet
- Title
- Size:
- Date:
- A3
- Number:
- Time:
- Revision:
- Sheet
- of
- File:

### Library data of the parts
ChAnd ChIP ChTC ChUSB = Header 5: ورودی از شارژر اندرویید; LatestRevisionDate: 17-Jul-2002; LatestRevisionNote: Re-released for DXP Platform.; Publisher: Altium Limited
D1-D8 = STPS2L60A: SCHOTTKY RECTIFIER 2A; Voltage Vrrm: 60V; Diode Case Style: DO-214AC; Case Style: DO-214AC; pin to pad: 1>A 2>A; MF: STMicroelectronics; Price: None; Availability: Unavailable; SnapEDA_Link: https://www.snapeda.com/parts/STPS2L60A/STMicroelectronics/view-part/?ref=snap; Package: DO-214 STMicroelectronics; MP: STPS2L60A; Value: *
JAnd JIP JTC JUSB = Header 3: جامپر انتخاب بین 5 ثابت خروجی (منبع تغذیه ثابت) یا انتخاب خروجی شارژر برای قفسه; LatestRevisionDate: 17-Jul-2002; LatestRevisionNote: Re-released for DXP Platform.; Publisher: Altium Limited
optSupAnd optSupIP optSupTC optSupUSB = Header 2: اگر شارژر ورودی 12 ولت داشته باشد این جامپر 12 ولت بایستی وصل شود; LatestRevisionDate: 17-Jul-2002; LatestRevisionNote: Re-released for DXP Platform.; Publisher: Altium Limited
PHC = Header 12: Header, 12-Pin; LatestRevisionDate: 17-Jul-2002; LatestRevisionNote: Re-released for DXP Platform.; Publisher: Altium Limited
Q1-Q8 = IPD50P04P4L-11: P-Channel 40 V 10.6 mOhm OptiMOSآ®-P2 Power-Transistor -PG-TO-252-3; MF: Infineon Technologies; MP: IPD50P04P4L-11; Package: TO-252-3 Infineon; Price: None; Availability: Unavailable; SnapEDA_Link: https://www.snapeda.com/parts/IPD50P04P4L-11/Infineon%20Technologies/view-part/?ref=snap; Value: *
R1-R16 = Res1: Resistor; Published: 8-Jun-2000; LatestRevisionDate: 17-Jul-2002; LatestRevisionNote: Re-released for DXP Platform.; PackageReference: AXIAL-0.3; Publisher: Altium Limited; PackageDescription: Axial Device, Thru-Hole; 2 Leads; 0.3 in Pin Spacing
SR1 = Res Pack3: Isolated Resistor Network; Published: 24-Mar-1999; LatestRevisionDate: 29-May-2009; LatestRevisionNote: IPC-7351 Footprint Added.; PackageReference: SO-16; Publisher: Altium Limited; PackageDescription: 16-Pin Small Outline Integrated Circuit 1.27 mm Pitch; Code_JEDEC: MS-012-AC; Code_IPC: SOIC127P600-16

## Sheet MotorMosfet.SchDoc
size A4
Used 7 times, as channels MotFet, MotFet, MotFet, MotFet, MotFet, MotFet, MotFet. Parts and nets are listed once, with the designators drawn on the sheet.
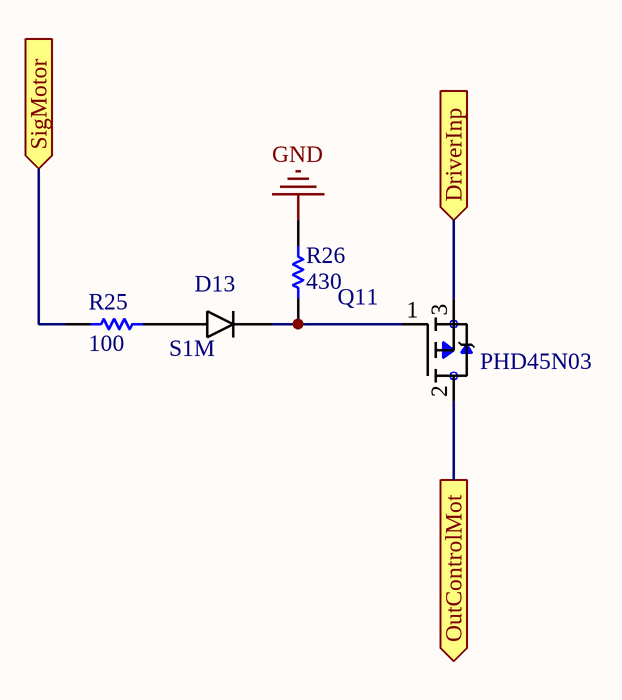
[diagram p3: MotorMosfet.SchDoc]

### Parts
D13  S1M  [*DIOM5227X270N_S1M(Primary)]
Q11  PHD45N03  [*DPAK228P998X235-3N]
R25  value 100  [6-0805_L]  (hidden comment: R100)
R26  value 430  [6-0805_L]  (hidden comment: R430)

### Ports
DriverInp (in), OutControlMot (out), SigMotor (in)

### Nets
GND: R26.1
DriverInp: Q11.3(S) ; port DriverInp
OutControlMot: Q11.2(D) ; port OutControlMot
SigMotor: R25.1 ; port SigMotor
NetD13_A: D13.A R25.2
NetD13_C: D13.C(K) Q11.1(G) R26.2

### Channels
MotFet: designators end in _MotFet7; ports DriverInp=DriverPin1 OutControlMot=MoX1 SigMotor=MoX1Sig
MotFet: designators end in _MotFet6; ports DriverInp=DriverPin1 OutControlMot=MoX2 SigMotor=MoX2Sig
MotFet: designators end in _MotFet5; ports DriverInp=DriverPin2 OutControlMot=MoY5 SigMotor=MoY5Sig
MotFet: designators end in _MotFet4; ports DriverInp=DriverPin2 OutControlMot=MoY4 SigMotor=MoY4Sig
MotFet: designators end in _MotFet3; ports DriverInp=DriverPin2 OutControlMot=MoY3 SigMotor=MoY3Sig
MotFet: designators end in _MotFet2; ports DriverInp=DriverPin2 OutControlMot=MoY2 SigMotor=MoY2Sig
MotFet: designators end in _MotFet1; ports DriverInp=DriverPin2 OutControlMot=MoY1 SigMotor=MoY1Sig

### Notes on the sheet
- Title
- Size:
- Date:
- A4
- Number:
- Time:
- Revision:
- Sheet
- of
- File:

### Library data of the parts
D13 = S1M: S1 Series 1000 V 1 A 1 uA Surface Mount General Purpose Rectifier - DO-214AC; MF: ON Semiconductor; Price: None; Availability: Unavailable; SnapEDA_Link: https://www.snapeda.com/parts/S1M/ON%20Semiconductor/view-part/?ref=snap; Package: DO-214AC-214 ON Semiconductor; MP: S1M; Value: *
Q11 = IPD50P04P4L-11: as Q1 on sheet ChargerControl; MP: IPD50P04P4L-11; Package: TO-252-3 Infineon; Price: None; Availability: Unavailable; SnapEDA_Link: https://www.snapeda.com/parts/IPD50P04P4L-11/Infineon%20Technologies/view-part/?ref=snap; Value: *
R25 R26 = Res1: Resistor; Published: 8-Jun-2000; LatestRevisionDate: 17-Jul-2002; LatestRevisionNote: Re-released for DXP Platform.; PackageReference: AXIAL-0.3; Publisher: Altium Limited; PackageDescription: Axial Device, Thru-Hole; 2 Leads; 0.3 in Pin Spacing

## Sheet 3_3Reg.SchDoc
size A4
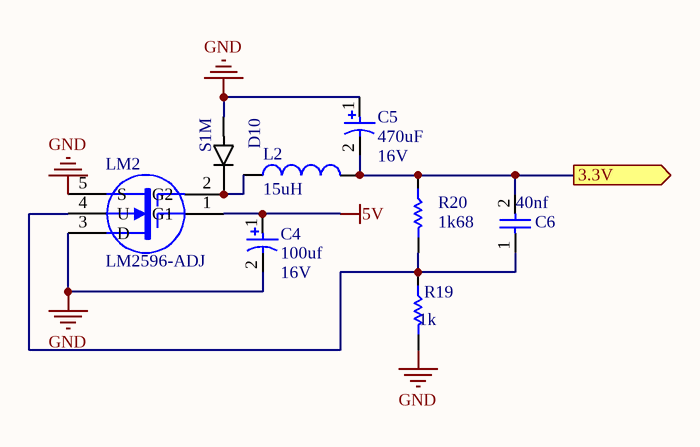
[diagram p4: 3_3Reg.SchDoc]

### Parts
C4  100uf  [RB5-10.5]
C5  470uF  [RB5-10.5]
C6  40nf  [6-0805_L]
D10  S1M  [*DIOM5227X270N_S1M(Primary)]
L2  15uH  [IND_SMD-13.0mm]
LM2  LM2596-ADJ  [T05A]
R19  1k  [6-0805_L]
R20  1k68  [6-0805_L]

### Ports
3.3V (out)

### Nets
5V: C4.1 LM2.1(G1)
GND: C4.2 C5.1 D10.A LM2.3(D) LM2.5(S) R19.2
3.3V: C5.2 C6.2 L2.2 R20.1 ; port 3.3V
NetC6_1: C6.1 LM2.4(U) R19.1 R20.2
NetD10_C: D10.C(K) L2.1 LM2.2(G2)

### Notes on the sheet
- Title
- Size:
- Date:
- A4
- Number:
- Time:
- Revision:
- Sheet
- of
- File:
- (in symbol CAP) 16V

### Library data of the parts
C4 C5 = CAP
C6 = CAP NON
D10 = S1M: as D13 on sheet MotorMosfet; Price: None; Availability: Unavailable; SnapEDA_Link: https://www.snapeda.com/parts/S1M/ON%20Semiconductor/view-part/?ref=snap; Package: DO-214AC-214 ON Semiconductor; MP: S1M; Value: *
L2 = Inductor
LM2 = MOSFET-N3: Two-Gate, N-Channel MOSFET, Externally Terminated Substrate; Published: 24-Mar-1999; LatestRevisionDate: 17-Jul-2002; LatestRevisionNote: Re-released for DXP Platform.; PackageReference: T05A; Publisher: Altium Limited; PackageDescription: TO-220, Molded, 5 Lead, Straight; Code_JEDEC: TS-001-AA
R19 R20 = RESISTOR

## Sheet 2Reg.SchDoc
size A4
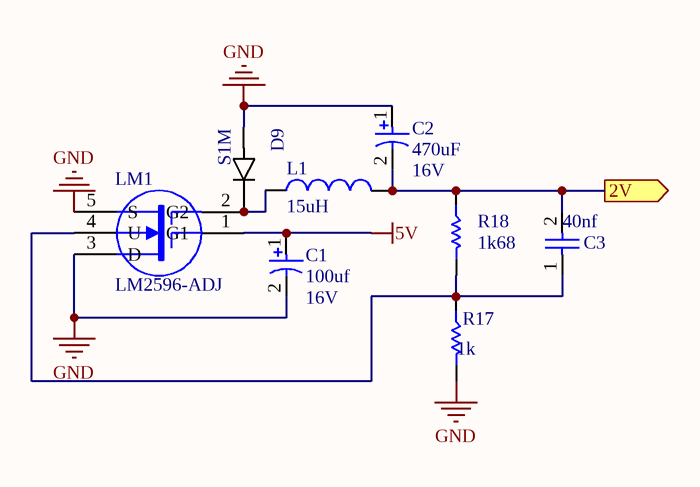
[diagram p5: 2Reg.SchDoc]

### Parts
C1  100uf  [RB5-10.5]
C2  470uF  [RB5-10.5]
C3  40nf  [6-0805_L]
D9  S1M  [*DIOM5227X270N_S1M(Primary)]
L1  15uH  [IND_SMD-13.0mm]
LM1  LM2596-ADJ  [T05A]
R17  1k  [6-0805_L]
R18  1k68  [6-0805_L]

### Ports
2V (out)

### Nets
5V: C1.1 LM1.1(G1)
GND: C1.2 C2.1 D9.A LM1.3(D) LM1.5(S) R17.2
2V: C2.2 C3.2 L1.2 R18.1 ; port 2V
NetC3_1: C3.1 LM1.4(U) R17.1 R18.2
NetD9_C: D9.C(K) L1.1 LM1.2(G2)

### Notes on the sheet
- Title
- Size:
- Date:
- A4
- Number:
- Time:
- Revision:
- Sheet
- of
- File:
- (in symbol CAP) 16V

### Library data of the parts
C1 C2 = CAP
C3 = CAP NON
D9 = S1M: as D13 on sheet MotorMosfet; Price: None; Availability: Unavailable; SnapEDA_Link: https://www.snapeda.com/parts/S1M/ON%20Semiconductor/view-part/?ref=snap; Package: DO-214AC-214 ON Semiconductor; MP: S1M; Value: *
L1 = Inductor
LM1 = MOSFET-N3: as LM2 on sheet 3_3Reg; Published: 24-Mar-1999; LatestRevisionDate: 17-Jul-2002; LatestRevisionNote: Re-released for DXP Platform.; PackageReference: T05A; Publisher: Altium Limited; PackageDescription: TO-220, Molded, 5 Lead, Straight; Code_JEDEC: TS-001-AA
R17 R18 = RESISTOR

## Sheet HighCurrentFetVcc.SchDoc
size A4
Used 10 times, as channels HCFetV, HCFetV, HCFetV, HCFetV, HCFetV, HCFetV, HCFetV, HCFetV, HCFetV, HCFetV. Parts and nets are listed once, with the designators drawn on the sheet.
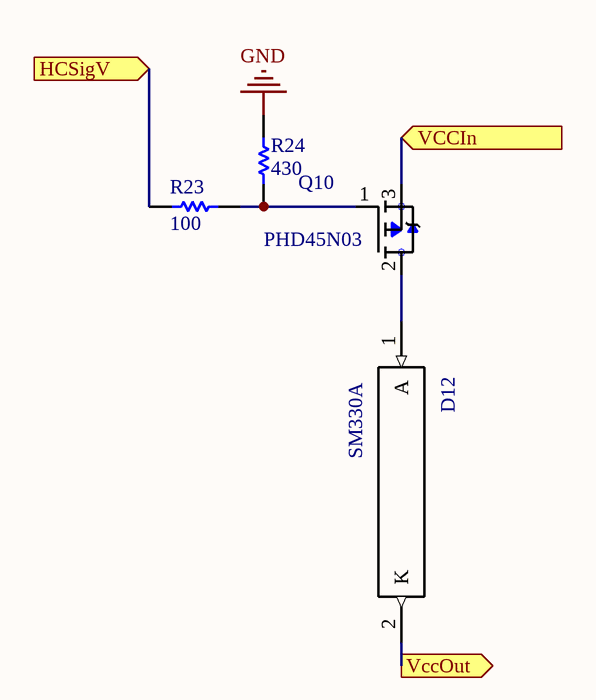
[diagram p6: HighCurrentFetVcc.SchDoc]

### Parts
D12  SM330A  [*DIOM5227X270N_S1M(Primary)]
Q10  PHD45N03  [*DPAK228P998X235-3N]
R23  value 100  [6-0805_L]  (hidden comment: R100)
R24  value 430  [6-0805_L]  (hidden comment: R430)

### Ports
HCSigV (in), VCCIn (in), VccOut (out)

### Nets
GND: R24.1
HCSigV: R23.1 ; port HCSigV
VCCIn: Q10.3(S) ; port VCCIn
VccOut: D12.2(K) ; port VccOut
NetD12_1: D12.1(A) Q10.2(D)
NetQ10_1: Q10.1(G) R23.2 R24.2

### Channels
HCFetV: designators end in _HCFetV10; ports HCSigV=NetR23_HCFetV10_1 VCCIn=12V VccOut=Lock1-12V
HCFetV: designators end in _HCFetV9; ports HCSigV=NetR23_HCFetV9_1 VCCIn=12V VccOut=F1-12V
HCFetV: designators end in _HCFetV8; ports HCSigV=NetR23_HCFetV8_1 VCCIn=2V VccOut=LG1-2V
HCFetV: designators end in _HCFetV7; ports HCSigV=NetR23_HCFetV7_1 VCCIn=2V VccOut=LY1-2V
HCFetV: designators end in _HCFetV6; ports HCSigV=NetR23_HCFetV6_1 VCCIn=2V VccOut=LR1-2V
HCFetV: designators end in _HCFetV5; ports HCSigV=NetR23_HCFetV5_1 VCCIn=12V VccOut=Lock2-12V
HCFetV: designators end in _HCFetV4; ports HCSigV=NetR23_HCFetV4_1 VCCIn=12V VccOut=F2-12V
HCFetV: designators end in _HCFetV3; ports HCSigV=NetR23_HCFetV3_1 VCCIn=2V VccOut=LG2-2V
HCFetV: designators end in _HCFetV2; ports HCSigV=NetR23_HCFetV2_1 VCCIn=2V VccOut=LY2-2V
HCFetV: designators end in _HCFetV1; ports HCSigV=NetR23_HCFetV1_1 VCCIn=2V VccOut=LR2-2V

### Notes on the sheet
- Title
- Size:
- Date:
- A4
- Number:
- Time:
- Revision:
- Sheet
- of
- File:

### Library data of the parts
D12 = STPS2L60A: SCHOTTKY RECTIFIER 2A; Voltage Vrrm: 60V; Diode Case Style: DO-214AC; Case Style: DO-214AC; pin to pad: 1>A 2>A; MF: STMicroelectronics; Price: None; Availability: Unavailable; SnapEDA_Link: https://www.snapeda.com/parts/STPS2L60A/STMicroelectronics/view-part/?ref=snap; Package: DO-214 STMicroelectronics; MP: STPS2L60A; Value: *
Q10 = IPD50P04P4L-11: as Q1 on sheet ChargerControl; MP: IPD50P04P4L-11; Package: TO-252-3 Infineon; Price: None; Availability: Unavailable; SnapEDA_Link: https://www.snapeda.com/parts/IPD50P04P4L-11/Infineon%20Technologies/view-part/?ref=snap; Value: *
R23 R24 = Res1: Resistor; Published: 8-Jun-2000; LatestRevisionDate: 17-Jul-2002; LatestRevisionNote: Re-released for DXP Platform.; PackageReference: AXIAL-0.3; Publisher: Altium Limited; PackageDescription: Axial Device, Thru-Hole; 2 Leads; 0.3 in Pin Spacing

## Sheet ShiftRegister.SchDoc
size A4
Used 6 times, as channels MotCtrl, ShelfSR, ShelfSR, ShelfSR, ShelfSR, ShelfSR. Parts and nets are listed once, with the designators drawn on the sheet.
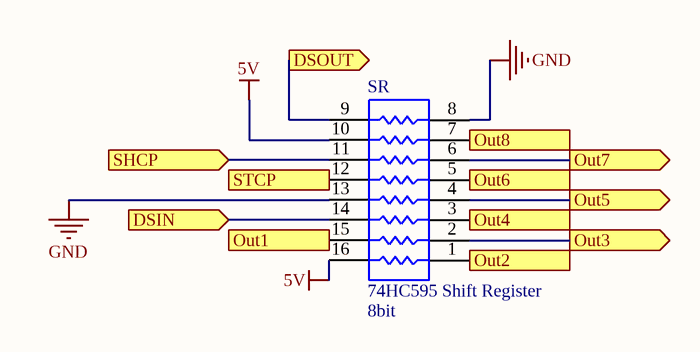
[diagram p7: ShiftRegister.SchDoc]

### Parts
SR  74HC595 Shift Register  value 8bit  [SO-16_L]

### Ports
DSIN (in), DSOUT (out), Out1 (out), Out2 (out), Out3 (out), Out4 (out), Out5 (out), Out6 (out), Out7 (out), Out8 (out), SHCP (in), STCP (in)

### Nets
5V: SR.10 SR.16
GND: SR.8 SR.13
DSIN: SR.14 ; port DSIN
DSOUT: SR.9 ; port DSOUT
Out1: SR.15 ; port Out1
Out2: SR.1 ; port Out2
Out3: SR.2 ; port Out3
Out4: SR.3 ; port Out4
Out5: SR.4 ; port Out5
Out6: SR.5 ; port Out6
Out7: SR.6 ; port Out7
Out8: SR.7 ; port Out8
SHCP: SR.11 ; port SHCP
STCP: SR.12 ; port STCP

### Channels
MotCtrl: designators end in _MotCtrl; ports DSIN=NetSR1_Ch10_9 DSOUT=NetSR_MotCtrl_9 Out1=MoX1Sig Out2=MoY1Sig Out3=MoY5Sig Out4=MoY3Sig Out5=MoY2Sig Out6=MoY4Sig Out7=MoX2Sig Out8=NetSR_MotCtrl_7 SHCP=SH_CP_5 STCP=ST_CP_6
ShelfSR: designators end in _ShelfSR5; ports DSIN=DS_4 DSOUT=DSSh2 Out1=NetR27_SensorLED13_2 Out2=NetR27_SensorLED14_2 Out3=NetR27_SensorLED8_2 Out4=NetR27_SensorLED10_2 Out5=NetR27_SensorLED11_2 Out6=NetR27_SensorLED9_2 Out7=NetR27_SensorLED12_2 Out8=NetR23_HCFetV10_1 SHCP=SH_CP_2 STCP=ST_CP_3
ShelfSR: designators end in _ShelfSR4; ports DSIN=DSSh2 DSOUT=DSSh3 Out1=NetR23_HCFetV9_1 Out2=NetR23_HCFetV7_1 Out3=NetR21_HCFetG8_1 Out4=NetR21_HCFetG10_1 Out5=NetR23_HCFetV6_1 Out6=NetR21_HCFetG9_1 Out7=NetR23_HCFetV8_1 Out8=NetR21_HCFetG7_1 SHCP=ST_CP_3 STCP=SH_CP_2
ShelfSR: designators end in _ShelfSR3; ports DSIN=DSSh3 DSOUT=DSSh4 Out1=NetR21_HCFetG6_1 Out2=NetR21_HCFetG4_1 Out3=NetSR_ShelfSR3_2 Out4=NetR21_HCFetG2_1 Out5=NetR21_HCFetG3_1 Out6=NetR21_HCFetG1_1 Out7=NetR21_HCFetG5_1 Out8=NetSR_ShelfSR3_7 SHCP=ST_CP_3 STCP=SH_CP_2
ShelfSR: designators end in _ShelfSR2; ports DSIN=DSSh4 DSOUT=DSSh5 Out1=NetR27_SensorLED6_2 Out2=NetR27_SensorLED7_2 Out3=NetR27_SensorLED1_2 Out4=NetR27_SensorLED3_2 Out5=NetR27_SensorLED4_2 Out6=NetR27_SensorLED2_2 Out7=NetR27_SensorLED5_2 Out8=NetR23_HCFetV5_1 SHCP=ST_CP_3 STCP=SH_CP_2
ShelfSR: designators end in _ShelfSR1; ports DSIN=DSSh5 DSOUT=NetSR_ShelfSR1_9 Out1=NetR23_HCFetV4_1 Out2=NetR23_HCFetV2_1 Out3=NetSR_ShelfSR1_2 Out4=NetSR_ShelfSR1_3 Out5=NetR23_HCFetV1_1 Out6=NetSR_ShelfSR1_5 Out7=NetR23_HCFetV3_1 Out8=NetSR_ShelfSR1_7 SHCP=ST_CP_3 STCP=SH_CP_2

### Notes on the sheet
- Title
- Size:
- Date:
- A4
- Number:
- Time:
- Revision:
- Sheet
- of
- File:

### Library data of the parts
SR = Res Pack3: Isolated Resistor Network; Published: 24-Mar-1999; LatestRevisionDate: 29-May-2009; LatestRevisionNote: IPC-7351 Footprint Added.; PackageReference: SO-16; Publisher: Altium Limited; PackageDescription: 16-Pin Small Outline Integrated Circuit 1.27 mm Pitch; Code_JEDEC: MS-012-AC; Code_IPC: SOIC127P600-16

## Sheet SenLEDFet.SchDoc
size A4
Used 14 times, as channels SensorLED, SensorLED, SensorLED, SensorLED, SensorLED, SensorLED, SensorLED, SensorLED, SensorLED, SensorLED, SensorLED, SensorLED, SensorLED, SensorLED. Parts and nets are listed once, with the designators drawn on the sheet.
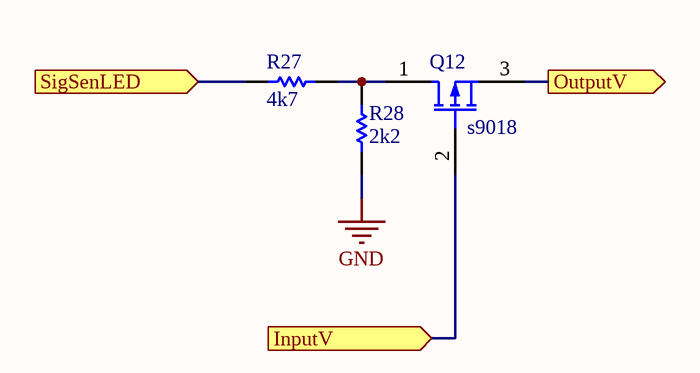
[diagram p8: SenLEDFet.SchDoc]

### Parts
Q12  s9018  [SOT-23_N]
R27  value 4k7  [6-0805_L]  (hidden comment: R4k7)
R28  value 2k2  [6-0805_L]  (hidden comment: R2k2)

### Ports
InputV (in), OutputV (out), SigSenLED (in)

### Nets
GND: R28.2
InputV: Q12.2(G) ; port InputV
OutputV: Q12.3(S) ; port OutputV
SigSenLED: R27.2 ; port SigSenLED
NetQ12_1: Q12.1(D) R27.1 R28.1

### Channels
SensorLED: designators end in _SensorLED14; ports InputV=2V OutputV=LAnd1-2V SigSenLED=NetR27_SensorLED14_2
SensorLED: designators end in _SensorLED13; ports InputV=3.3V OutputV=Sen1-3.3V SigSenLED=NetR27_SensorLED13_2
SensorLED: designators end in _SensorLED12; ports InputV=2V OutputV=LSen1-2V SigSenLED=NetR27_SensorLED12_2
SensorLED: designators end in _SensorLED11; ports InputV=2V OutputV=LIP1-2V SigSenLED=NetR27_SensorLED11_2
SensorLED: designators end in _SensorLED10; ports InputV=2V OutputV=LTC1-2V SigSenLED=NetR27_SensorLED10_2
SensorLED: designators end in _SensorLED9; ports InputV=2V OutputV=LUSB1-2V SigSenLED=NetR27_SensorLED9_2
SensorLED: designators end in _SensorLED8; ports InputV=2V OutputV=LDC1-2V SigSenLED=NetR27_SensorLED8_2
SensorLED: designators end in _SensorLED7; ports InputV=2V OutputV=LAnd2-2V SigSenLED=NetR27_SensorLED7_2
SensorLED: designators end in _SensorLED6; ports InputV=3.3V OutputV=Sen2-3.3V SigSenLED=NetR27_SensorLED6_2
SensorLED: designators end in _SensorLED5; ports InputV=2V OutputV=LSen2-2V SigSenLED=NetR27_SensorLED5_2
SensorLED: designators end in _SensorLED4; ports InputV=2V OutputV=LIP2-2V SigSenLED=NetR27_SensorLED4_2
SensorLED: designators end in _SensorLED3; ports InputV=2V OutputV=LTC2-2V SigSenLED=NetR27_SensorLED3_2
SensorLED: designators end in _SensorLED2; ports InputV=2V OutputV=LUSB2-2V SigSenLED=NetR27_SensorLED2_2
SensorLED: designators end in _SensorLED1; ports InputV=2V OutputV=LDC2-2V SigSenLED=NetR27_SensorLED1_2

### Notes on the sheet
- Title
- Size:
- Date:
- A4
- Number:
- Time:
- Revision:
- Sheet
- of
- File:

### Library data of the parts
Q12 = MOSFET-P: P-Channel MOSFET; Published: 8-Jun-2000; LatestRevisionDate: 17-Jul-2002; LatestRevisionNote: Re-released for DXP Platform.; PackageVersion: 1995/1996; PackageReference: E3; Publisher: Altium Limited; PackageDescription: TO, Flat Index; 3 In-Line, Axial Leads; Body Dia. 4.6mm; Lead Dia. 0.5 mm (max)
R27 R28 = Res1: Resistor; Published: 8-Jun-2000; LatestRevisionDate: 17-Jul-2002; LatestRevisionNote: Re-released for DXP Platform.; PackageReference: AXIAL-0.3; Publisher: Altium Limited; PackageDescription: Axial Device, Thru-Hole; 2 Leads; 0.3 in Pin Spacing